# Altium project BC-MPR.PrjPcb (part 1 of 2)
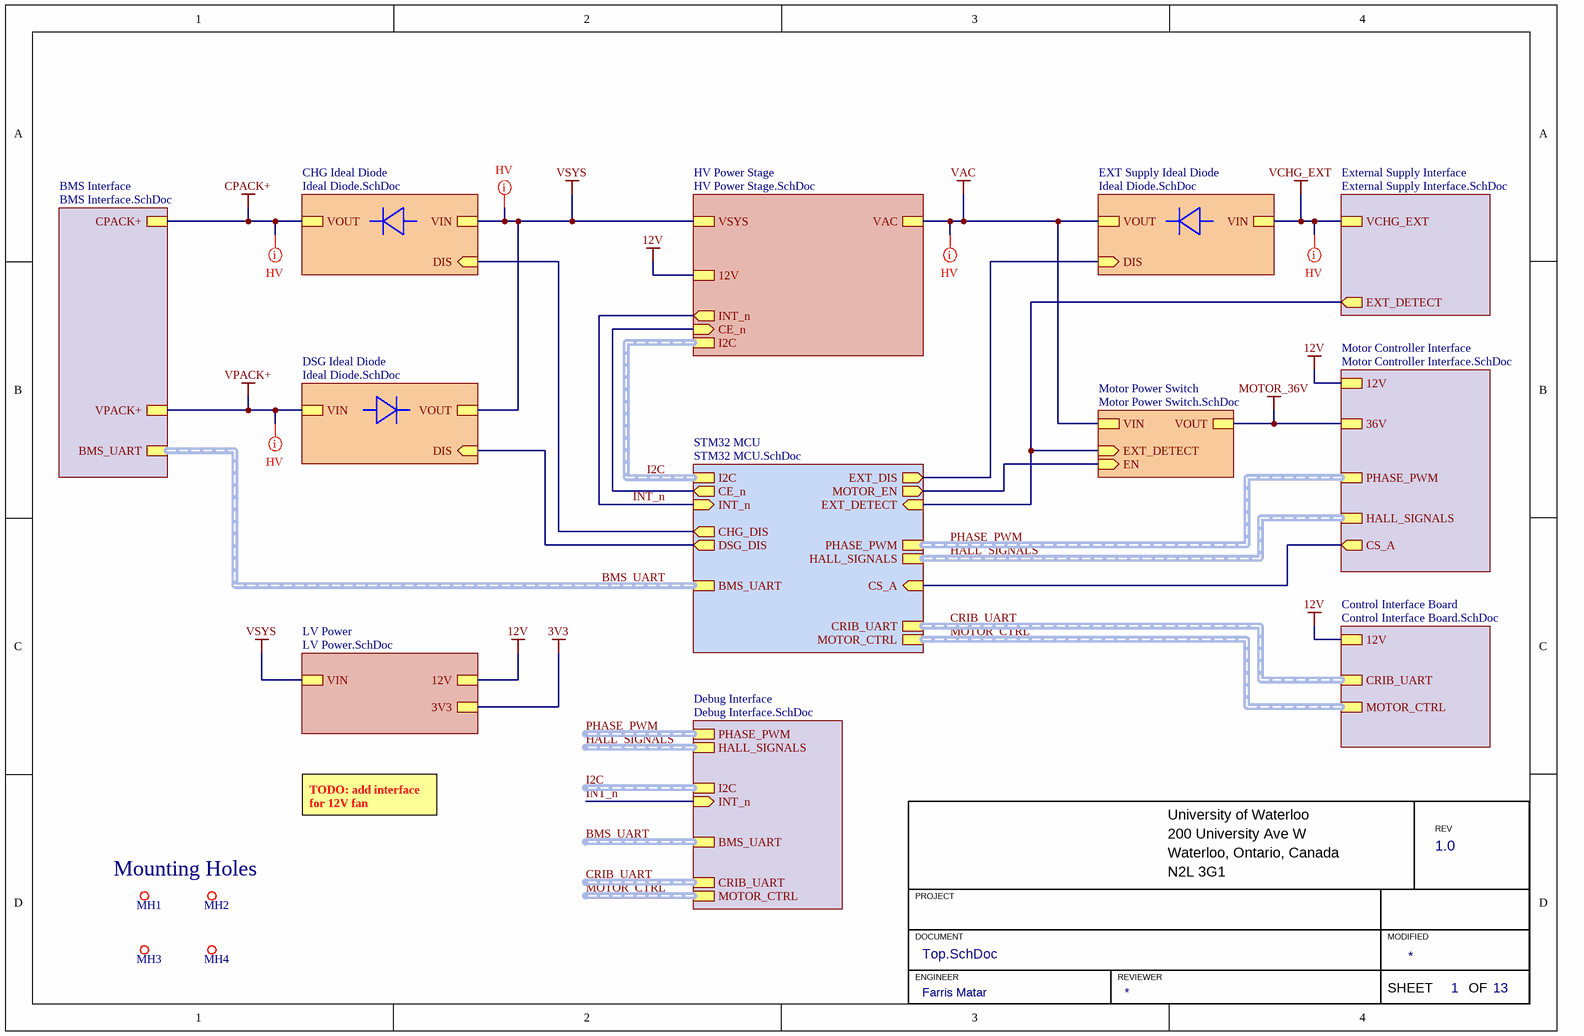
[diagram p0: Top.SchDoc]
Engineer: Farris Matar; Revision: 1.0
12 sheets, 243 parts. Net scope: hierarchical (ports join the sheet entries above them; power ports are global).
Board file: BC-MPR.PcbDoc
Sheets:
  Top.SchDoc
    CHG Ideal Diode = Ideal Diode.SchDoc
    DSG Ideal Diode = Ideal Diode.SchDoc
    EXT Supply Ideal Diode = Ideal Diode.SchDoc
    Motor Controller Interface = Motor Controller Interface.SchDoc
    Motor Power Switch = Motor Power Switch.SchDoc
    LV Power = LV Power.SchDoc
    HV Power Stage = HV Power Stage.SchDoc
      BQ25756 Data & Config = BQ25756 Data Config.SchDoc
    STM32 MCU = STM32 MCU.SchDoc
      MCU Power, Clock, & Debug = MCU Power Clock Debug.SchDoc
    Control Interface Board = Control Interface Board.SchDoc
    External Supply Interface = External Supply Interface.SchDoc
  Fan Power Switch.SchDoc

## Sheet Top.SchDoc
size A4; Engineer: Farris Matar; Organization: TESLA Motors, INC; Address1: 3500 Deer Creek Road; Address2: Palo Alto, CA; Address4: U.S.A.; SheetNumber: 1; SheetTotal: 13

### Parts
MH1  MOUNTING_HOLE_M3  [MOUNTING_HOLE_3mm]  (value not drawn)  (no BOM)
MH2  MOUNTING_HOLE_M3  [MOUNTING_HOLE_3mm]  (value not drawn)  (no BOM)
MH3  MOUNTING_HOLE_M3  [MOUNTING_HOLE_3mm]  (value not drawn)  (no BOM)
MH4  MOUNTING_HOLE_M3  [MOUNTING_HOLE_3mm]  (value not drawn)  (no BOM)

### Sub-sheets
BMS Interface = BMS Interface.SchDoc (file not in this document): BMS_UART (harness UART), VPACK+, CPACK+
CHG Ideal Diode = Ideal Diode.SchDoc: VOUT, VIN, DIS (in)
Control Interface Board = Control Interface Board.SchDoc: CRIB_UART (harness UART), MOTOR_CTRL (harness MOTOR CTRL), 12V
Debug Interface = Debug Interface.SchDoc (file not in this document): BMS_UART (harness UART), CRIB_UART (harness UART), I2C (harness I2C), HALL_SIGNALS (harness HALL SIGNALS), PHASE_PWM (harness PHASE PWM), MOTOR_CTRL (harness MOTOR CTRL), INT_n (in)
DSG Ideal Diode = Ideal Diode.SchDoc: VOUT, VIN, DIS (in)
EXT Supply Ideal Diode = Ideal Diode.SchDoc: VOUT, VIN, DIS (in)
External Supply Interface = External Supply Interface.SchDoc: VCHG_EXT, EXT_DETECT (out)
HV Power Stage = HV Power Stage.SchDoc: VSYS, VAC, 12V, INT_n (out), I2C (harness I2C), CE_n (in)
LV Power = LV Power.SchDoc: VIN, 12V, 3V3
Motor Controller Interface = Motor Controller Interface.SchDoc: 36V, 12V, CS_A (out), PHASE_PWM (harness PHASE PWM), HALL_SIGNALS (harness HALL SIGNALS)
Motor Power Switch = Motor Power Switch.SchDoc: VIN, VOUT, EN (in), EXT_DETECT (in)
STM32 MCU = STM32 MCU.SchDoc: HALL_SIGNALS (harness HALL SIGNALS), PHASE_PWM (harness PHASE PWM), CS_A (in), BMS_UART (harness UART), MOTOR_EN (out), EXT_DIS (out), I2C (harness I2C), CE_n (out), INT_n (in), CHG_DIS (out), DSG_DIS (out), CRIB_UART (harness UART), EXT_DETECT (in), MOTOR_CTRL (harness MOTOR CTRL)

### Nets
12V: sheet Motor Controller Interface/12V, sheet LV Power/12V, sheet HV Power Stage/12V, sheet Control Interface Board/12V
CPACK+: sheet CHG Ideal Diode/VOUT, sheet BMS Interface/CPACK+
MOTOR_36V: sheet Motor Controller Interface/36V, sheet Motor Power Switch/VOUT
VAC: sheet EXT Supply Ideal Diode/VOUT, sheet Motor Power Switch/VIN, sheet HV Power Stage/VAC
VCHG_EXT: sheet EXT Supply Ideal Diode/VIN, sheet External Supply Interface/VCHG_EXT
VPACK+: sheet DSG Ideal Diode/VIN, sheet BMS Interface/VPACK+
VSYS: sheet CHG Ideal Diode/VIN, sheet DSG Ideal Diode/VOUT, sheet LV Power/VIN, sheet HV Power Stage/VSYS
CE_n: sheet HV Power Stage/CE_n, sheet STM32 MCU/CE_n
CHG_DIS: sheet CHG Ideal Diode/DIS, sheet STM32 MCU/CHG_DIS
CS_A: sheet Motor Controller Interface/CS_A, sheet STM32 MCU/CS_A
DSG_DIS: sheet DSG Ideal Diode/DIS, sheet STM32 MCU/DSG_DIS
EXT_DETECT: sheet Motor Power Switch/EXT_DETECT, sheet STM32 MCU/EXT_DETECT, sheet External Supply Interface/EXT_DETECT
EXT_DIS: sheet EXT Supply Ideal Diode/DIS, sheet STM32 MCU/EXT_DIS
INT_n: sheet HV Power Stage/INT_n, sheet STM32 MCU/INT_n, sheet Debug Interface/INT_n
MOTOR_EN: sheet Motor Power Switch/EN, sheet STM32 MCU/MOTOR_EN

### Buses and harness runs
harness BMS_UART = sheet BMS Interface/BMS_UART = sheet STM32 MCU/BMS_UART
harness BMS_UART = sheet Debug Interface/BMS_UART
harness CRIB_UART = sheet Control Interface Board/CRIB_UART = sheet STM32 MCU/CRIB_UART
harness CRIB_UART = sheet Debug Interface/CRIB_UART
harness HALL_SIGNALS = sheet Debug Interface/HALL_SIGNALS
harness HALL_SIGNALS = sheet Motor Controller Interface/HALL_SIGNALS = sheet STM32 MCU/HALL_SIGNALS
harness I2C = sheet Debug Interface/I2C
harness I2C = sheet HV Power Stage/I2C = sheet STM32 MCU/I2C
harness MOTOR_CTRL = sheet Control Interface Board/MOTOR_CTRL = sheet STM32 MCU/MOTOR_CTRL
harness MOTOR_CTRL = sheet Debug Interface/MOTOR_CTRL
harness PHASE_PWM = sheet Debug Interface/PHASE_PWM
harness PHASE_PWM = sheet Motor Controller Interface/PHASE_PWM = sheet STM32 MCU/PHASE_PWM

### Layout directives
net class HV: CPACK+, VAC, VCHG_EXT, VPACK+, VSYS

### Notes on the sheet
- TODO: add interface for 12V fan
- University of Waterloo
- 200 University Ave W
- REV
- Mounting Holes
- PROJECT
- Waterloo, Ontario, Canada
- N2L 3G1
- DOCUMENT
- ENGINEER
- REVIEWER
- MODIFIED
- SHEET
- OF

## Sheet Ideal Diode.SchDoc
size A4; Engineer: Farris Matar; Organization: TESLA Motors, INC; Address1: 3500 Deer Creek Road; Address2: Palo Alto, CA; Address4: U.S.A.; SheetNumber: 2; SheetTotal: 9
Used 3 times, as channels CHG Ideal Diode, DSG Ideal Diode, EXT Supply Ideal Diode. Parts and nets are listed once, with the designators drawn on the sheet.
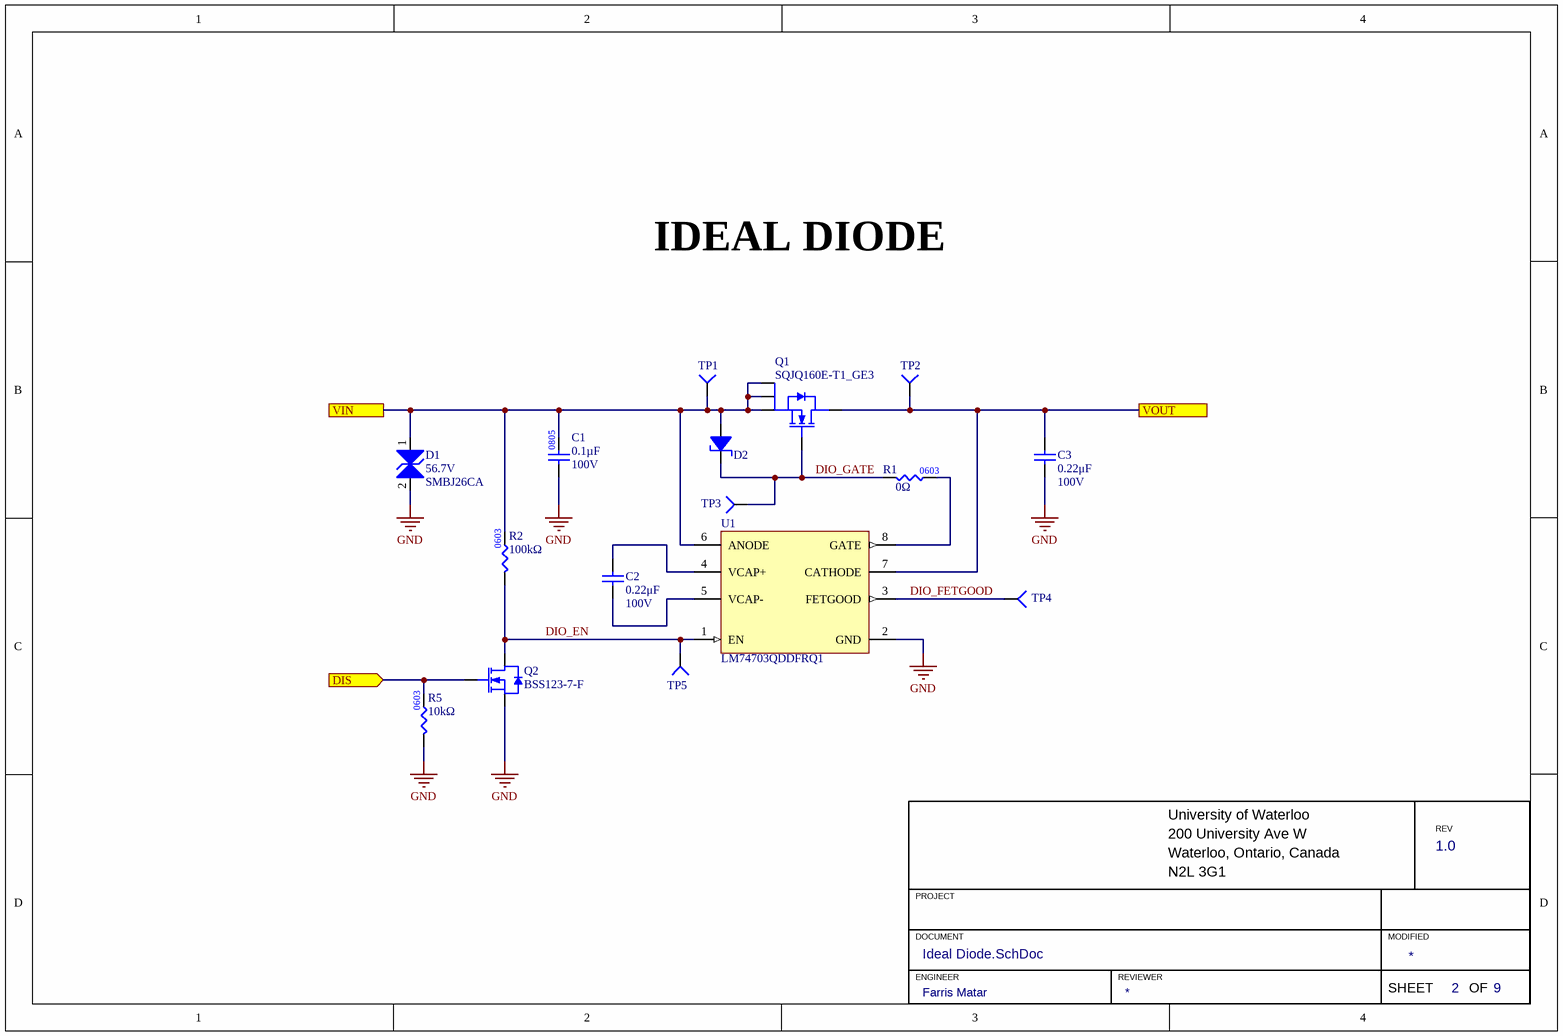
[diagram p1: Ideal Diode.SchDoc]

### Parts
C1  value 0.1µF  Voltage Rating: 100V  [CAP0805]  (hidden comment: CAP_0.1uF_100V_0805)
C2  value 0.22μF  Voltage Rating: 100V  [CAP0805]  (hidden comment: CAP_0.22uF_100V_0805)
C3  value 0.22μF  Voltage Rating: 100V  [CAP0805]  (hidden comment: CAP_0.22uF_100V_0805)
D1  Voltage - Breakdown (Min): 56.7V  Manufacturer Part Number 1: SMBJ26CA  [TVS_DIODE_BIDIR_SMB]  (hidden comment: TVS_DIODE_BIDIR_51V)
D2  DIO_ZENER_16V  [SOD-123_FLAT]  (value not drawn)
Q1  Manufacturer Part Number 1: SQJQ160E-T1_GE3  [VISHAY_PowerPAK-8x8]  (hidden comment: NMOS_60V_603A)
Q2  Manufacturer Part Number 1: BSS123-7-F  [SOT23-3]  (hidden comment: NMOS_100V_170mA)
R1  value 0Ω  [RES0603]  (hidden comment: RES_0Ω_0603)
R2  value 100kΩ  [RES0603]  (hidden comment: RES_100kΩ_0603_1%)
R5  value 10kΩ  [RES0603]  (hidden comment: RES_10kΩ_0603_1%)
TP1  TESTPOINT_1MM_SQUARE  [TESTPOINT_SQUARE_1MM]  (value not drawn)  (no BOM)
TP2  TESTPOINT_1MM_SQUARE  [TESTPOINT_SQUARE_1MM]  (value not drawn)  (no BOM)
TP3  TESTPOINT_1MM_CIRCLE  [TESTPOINT_CIRCLE_1MM]  (value not drawn)  (no BOM)
TP4  TESTPOINT_1MM_CIRCLE  [TESTPOINT_CIRCLE_1MM]  (value not drawn)  (no BOM)
TP5  TESTPOINT_1MM_CIRCLE  [TESTPOINT_CIRCLE_1MM]  (value not drawn)  (no BOM)
U1  LM74703QDDFRQ1  [TI_SOT23-8]

### Ports
DIS (in), VIN, VOUT

### Nets
GND: C1.1 C3.1 D1.2 Q2.2(SOURCE) R5.1 U1.2(GND)
DIO_EN: Q2.3(DRAIN) R2.1 TP5.1(=value) U1.1(EN)
DIO_FETGOOD: TP4.1(=value) U1.3(FETGOOD)
DIO_GATE: D2.2(Cathode) Q1.1(Gate) R1.1 TP3.1(=value)
DIS: Q2.1(GATE) R5.2 ; port DIS
VIN: C1.2 D1.1 D2.1(Anode) Q1.2(Source) Q1.3(Source) Q1.4(Source) R2.2 TP1.1(=value) U1.6(ANODE) ; port VIN
VOUT: C3.2 Q1.5(Drain) TP2.1(=value) U1.7(CATHODE) ; port VOUT
NetC2_1: C2.1 U1.5(VCAP-)
NetC2_2: C2.2 U1.4(VCAP+)
NetR1_2: R1.2 U1.8(GATE)

### Channels
CHG Ideal Diode: designators end in A; ports DIS=CHG_DIS VIN=VSYS VOUT=CPACK+
DSG Ideal Diode: designators end in B; ports DIS=DSG_DIS VIN=VPACK+ VOUT=VSYS
EXT Supply Ideal Diode: designators end in C; ports DIS=EXT_DIS VIN=VCHG_EXT VOUT=VAC

### Notes on the sheet
- IDEAL DIODE
- University of Waterloo
- 200 University Ave W
- REV
- PROJECT
- Waterloo, Ontario, Canada
- N2L 3G1
- DOCUMENT
- ENGINEER
- REVIEWER
- MODIFIED
- SHEET
- OF
- (in symbol RES_100kΩ_0603_1%) 0603

### Library data of the parts
C1 = CAP_0.1uF_100V_0805: CAP CER 0.1UF 100V X7R 0805; Manufacturer 1: TDK Corporation; Manufacturer Part Number 1: C2012X7R2A104K125AA; Package: 0805; Supplier 1: Digi-Key; Supplier Part Number 1: 445-1418-1-ND
C2 C3 = CAP_0.22uF_100V_0805: CAP CER 0.22UF 100V X7R 0805; Manufacturer Part Number 1: HMJ212BB7224KGHT; Manufacturer 1: Taiyo Yuden; Mounting Type: SMD; Package: 0805; Dielectric: X7R; Supplier 1: Digi-Key; Supplier Part Number 1: 587-4221-1-ND
D1 = TVS_DIODE_BIDIR_51V: TVS DIODE 51VWM 82.4VC DO214AA; Manufacturer 1: Littelfuse; Package/Footprint: SMB; Voltage - Clamping (Max) @ Ipp: 82.4V; Voltage - Reverse Standoff (Typ): 51V; Mounting Type: SMD; Supplier 1: Digi-Key; Supplier Part Number 1: SMBJ51CALFCT-ND
D2 = DIO_ZENER_16V: DIODE ZENER 16V 500MW SOD123; Manufacturer Part Number 1: DDZ9703-7; Manufacturer 1: Diodes Incorporated; Forward Voltage: 900mV; Supplier 1: Digi-Key; Supplier Part Number 1: DDZ9703-7DICT-ND
Q1 = NMOS_60V_603A: AUTOMOTIVE N-CHANNEL 60 V (D-S); Manufacturer 1: Vishay Siliconix; Vdss: 60V; Vgs (Max): 20V; Power Dissipation (Max): 600W; Id: 603A; Supplier 1: Digi-Key; Supplier Part Number 1: 742-SQJQ160E-T1_GE3CT-ND; FET Type: N-Channel; Supplier Device Package: PowerPak 8x8
Q2 = NMOS_100V_170mA: MOSFET N-CH 100V 170MA SOT23-3; Manufacturer 1: Diodes Incorporated; Supplier 1: Digi-Key; Supplier Part Number 1: BSS123-FDICT-ND
R1 = RES_0Ω_0603: RES 0 OHM JUMPER 1/10W 0603; Manufacturer 1: Yageo; Manufacturer Part Number 1: RC0603JR-070RL; Supplier Part Number 1: 311-0.0GRCT-ND; Supplier 1: Digi-Key; Mounting Type: SMD; Package: 0603
R2 = RES_100kΩ_0603_1%: RES 100K OHM 1% 1/10W 0603; Manufacturer 1: Yageo; Manufacturer Part Number 1: RC0603FR-07100KL; Supplier Part Number 1: 311-100KHRCT-ND; Supplier 1: Digi-Key
R5 = RES_10kΩ_0603_1%: RES 10K OHM 1% 1/8W 0603; Manufacturer 1: Stackpole Electronics Inc; Manufacturer Part Number 1: RNCP0603FTD10K0; Supplier Part Number 1: RNCP0603FTD10K0CT-ND; Supplier 1: Digi-Key; Mounting Type: SMD; Package: 0603
TP1 TP2 = TESTPOINT_1MM_SQUARE: TESTPOINT 1MM SQUARE
TP3-TP5 = TESTPOINT_1MM_CIRCLE: TESTPOINT 1MM CIRCLE
U1 = LM74703QDDFRQ1: AUTOMOTIVE IDEAL DIODE CONTROLLE; Manufacturer 1: Texas Instruments; Package/Footprint: SOT-23; Manufacturer Part Number 1: LM74703QDDFRQ1; Supplier 1: Digikey; Supplier Part Number 1: 296-LM74703QDDFRQ1CT-ND

## Sheet Motor Controller Interface.SchDoc
size A4; Engineer: Farris Matar; Organization: TESLA Motors, INC; Address1: 3500 Deer Creek Road; Address2: Palo Alto, CA; Address4: U.S.A.; SheetNumber: 4; SheetTotal: 9
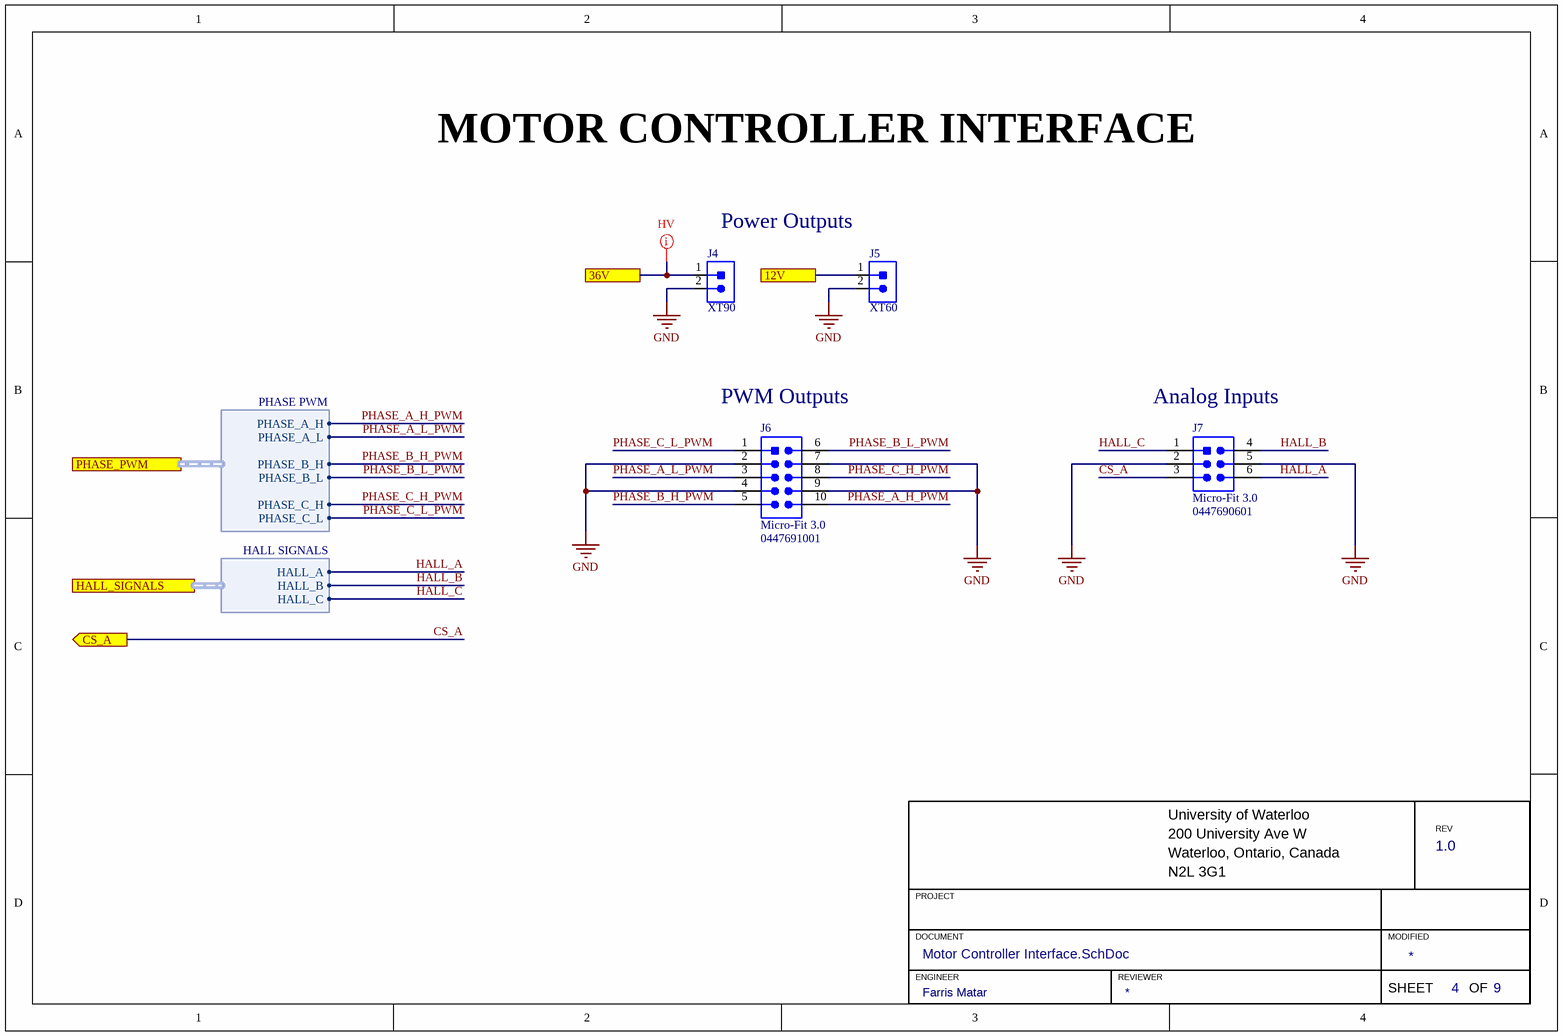
[diagram p2: Motor Controller Interface.SchDoc]

### Parts
J4  CON_2POS_XT90  [XT90]  (value not drawn)
J5  CON_2POS_XT60  [XT60]  (value not drawn)
J6  Family: Micro-Fit 3.0  [MOLEX-0447691001]  (hidden comment: 0447691001)
J7  Family: Micro-Fit 3.0  [MOLEX-0447690601]  (hidden comment: 0447690601)

### Ports
12V, 36V, CS_A (out), HALL_SIGNALS (harness HALL SIGNALS), PHASE_PWM (harness PHASE PWM)

### Harnesses
PHASE PWM: PHASE_A_H, PHASE_A_L, PHASE_B_H, PHASE_B_L, PHASE_C_H, PHASE_C_L
HALL SIGNALS: HALL_A, HALL_B, HALL_C

### Nets
12V: J5.1 ; port 12V
GND: J4.2 J5.2 J6.2 J6.4 J6.7 J6.9 J7.2 J7.5
MOTOR_36V: J4.1 ; port 36V
CS_A: J7.3 ; port CS_A
HALL_A: J7.6 ; port HALL_SIGNALS.HALL_A
HALL_B: J7.4 ; port HALL_SIGNALS.HALL_B
HALL_C: J7.1 ; port HALL_SIGNALS.HALL_C
PHASE_A_H_PWM: J6.10 ; port PHASE_PWM.PHASE_A_H
PHASE_A_L_PWM: J6.3 ; port PHASE_PWM.PHASE_A_L
PHASE_B_H_PWM: J6.5 ; port PHASE_PWM.PHASE_B_H
PHASE_B_L_PWM: J6.6 ; port PHASE_PWM.PHASE_B_L
PHASE_C_H_PWM: J6.8 ; port PHASE_PWM.PHASE_C_H
PHASE_C_L_PWM: J6.1 ; port PHASE_PWM.PHASE_C_L

### Layout directives
net class HV: MOTOR_36V

### Notes on the sheet
- MOTOR CONTROLLER INTERFACE
- Power Outputs
- (near J6) PWM Outputs
- (near J7) Analog Inputs
- University of Waterloo
- 200 University Ave W
- REV
- PROJECT
- Waterloo, Ontario, Canada
- N2L 3G1
- DOCUMENT
- ENGINEER
- REVIEWER
- MODIFIED
- SHEET
- OF

### Library data of the parts
J4 = CON_2POS_XT90: HIGH QUALITY GOLD PLATED XT90 MA; Manufacturer 1: DFRobot; Manufacturer Part Number 1: FIT0588; Mounting Type: TH; Package/Footprint: XT90; Supplier 1: Digi-Key; Supplier Part Number 1: 1738-1438-ND
J5 = CON_2POS_XT60: XT60 CONNECTORS MALE/FEMALE PAIR; Manufacturer 1: SparkFun Electronics; Manufacturer Part Number 1: PRT-10474; Mounting Type: TH; Package/Footprint: XT60; Supplier 1: Digi-Key; Supplier Part Number 1: 1568-1816-ND
J6 = CON_MOLEX-RCPT_5x2_TH: CONN RCPT 10POS 0.118 TIN PCB; Manufacturer 1: Molex; Voltage Rating: 250VAC; Current Rating: 5A; Pitch: 3mm; Supplier 1: Digi-Key; Supplier Part Number 1: WM1956-ND; Manufacturer Part Number 1: 0447691001
J7 = CON_MOLEX-RCPT_3x2_TH: CONN RCPT 6POS 0.118 TIN PCB; Manufacturer 1: Molex; Voltage Rating: 250VAC; Current Rating: 5A; Pitch: 3mm; Supplier 1: Digi-Key; Supplier Part Number 1: 23-0447690601-ND; Manufacturer Part Number 1: 0447690601

## Sheet Motor Power Switch.SchDoc
size A4; Engineer: Farris Matar; Organization: TESLA Motors, INC; Address1: 3500 Deer Creek Road; Address2: Palo Alto, CA; Address4: U.S.A.; SheetNumber: 4; SheetTotal: 13
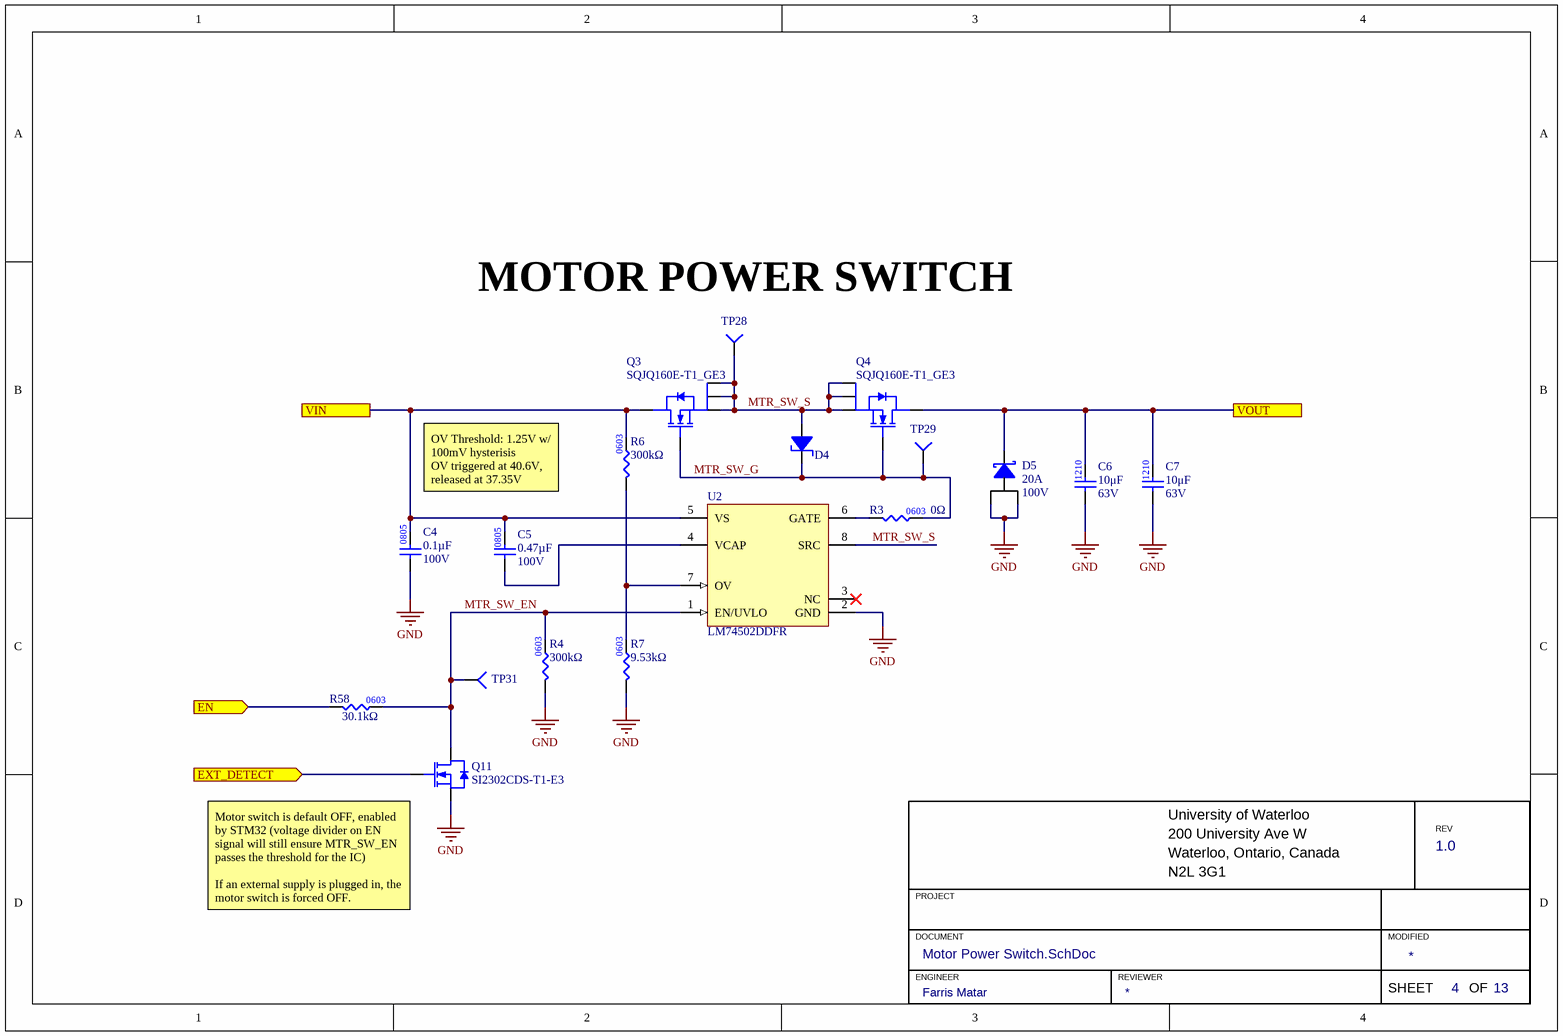
[diagram p3: Motor Power Switch.SchDoc]

### Parts
C4  value 0.1µF  Voltage Rating: 100V  [CAP0805]  (hidden comment: CAP_0.1uF_100V_0805)
C5  value 0.47µF  Voltage Rating: 100V  [CAP0805]  (hidden comment: CAP_0.47uF_100V_0805)
C6  value 10μF  Voltage Rating: 63V  [CAP1210]  (hidden comment: CAP_10uF_63V_1210)
C7  value 10μF  Voltage Rating: 63V  [CAP1210]  (hidden comment: CAP_10uF_63V_1210)
D4  DIO_ZENER_16V  [SOD-123_FLAT]  (value not drawn)
D5  Current - Average Rectified (Io): 20A  Vr (Max): 100V  [D-PAK]  (hidden comment: DIO_SCHOTTKY_100V_20A)
Q3  Manufacturer Part Number 1: SQJQ160E-T1_GE3  [VISHAY_PowerPAK-8x8]  (hidden comment: NMOS_60V_603A)
Q4  Manufacturer Part Number 1: SQJQ160E-T1_GE3  [VISHAY_PowerPAK-8x8]  (hidden comment: NMOS_60V_603A)
Q11  Manufacturer Part Number 1: SI2302CDS-T1-E3  [SOT23-3]  (hidden comment: NMOS_20V_6A)
R3  value 0Ω  [RES0603]  (hidden comment: RES_0Ω_0603)
R4  value 300kΩ  [RES0603]  (hidden comment: RES_300kΩ_0603_1%)
R6  value 300kΩ  [RES0603]  (hidden comment: RES_300kΩ_0603_1%)
R7  value 9.53kΩ  [RES0603]  (hidden comment: RES_9.53kΩ_0603_1%)
R58  value 30.1kΩ  [RES0603]  (hidden comment: RES_30.1kΩ_0603_1%)
TP28  TESTPOINT_1MM_SQUARE  [TESTPOINT_SQUARE_1MM]  (value not drawn)  (no BOM)
TP29  TESTPOINT_1MM_CIRCLE  [TESTPOINT_CIRCLE_1MM]  (value not drawn)  (no BOM)
TP31  TESTPOINT_1MM_CIRCLE  [TESTPOINT_CIRCLE_1MM]  (value not drawn)  (no BOM)
U2  LM74502DDFR  [TI_SOT23-8]

### Ports
EN (in), EXT_DETECT (in), VIN, VOUT

### Nets
GND: C4.1 C6.1 C7.1 D5.2(Anode) D5.3(Anode) Q11.2(SOURCE) R4.1 R7.1 U2.2(GND)
MOTOR_36V: C6.2 C7.2 D5.1(Cathode) Q4.5(Drain) ; port VOUT
VAC: C4.2 C5.2 Q3.5(Drain) R6.2 U2.5(VS) ; port VIN
EXT_DETECT: Q11.1(GATE) ; port EXT_DETECT
MOTOR_EN: R58.1 ; port EN
MTR_SW_EN: Q11.3(DRAIN) R4.2 R58.2 TP31.1(=value) U2.1(EN/UVLO)
MTR_SW_G: D4.2(Cathode) Q3.1(Gate) Q4.1(Gate) R3.2 TP29.1(=value)
MTR_SW_S: D4.1(Anode) Q3.2(Source) Q3.3(Source) Q3.4(Source) Q4.2(Source) Q4.3(Source) Q4.4(Source) TP28.1(=value) U2.8(SRC)
NetC5_1: C5.1 U2.4(VCAP)
NetR3_1: R3.1 U2.6(GATE)
NetR6_1: R6.1 R7.2 U2.7(OV)

Not connected (* = marked no-connect by the designer): U2 3(NC)*

### Notes on the sheet
- (near TP28) MOTOR POWER SWITCH
- OV Threshold: 1.25V w/ 100mV hysterisis
  OV triggered at 40.6V, released at 37.35V
- University of Waterloo
- 200 University Ave W
- REV
- (near Q11) Motor switch is default OFF, enabled by STM32 (voltage divider on EN signal will still ensure MTR_SW_EN passes the threshold for the IC)
  If an external supply is plugged in, the motor switch is forced OFF.
- PROJECT
- Waterloo, Ontario, Canada
- N2L 3G1
- DOCUMENT
- ENGINEER
- REVIEWER
- MODIFIED
- SHEET
- OF

### Library data of the parts
C4 = CAP_0.1uF_100V_0805: as C1 on sheet Ideal Diode; Package: 0805; Supplier 1: Digi-Key; Supplier Part Number 1: 445-1418-1-ND
C5 = CAP_0.47uF_100V_0805: CAP CER 0.47UF 100V X7R 0805; Manufacturer 1: YAGEO; Manufacturer Part Number 1: CC0805KKX7R0BB474; Package: 0805; Supplier 1: Digikey; Supplier Part Number 1: 13-CC0805KKX7R0BB474DKR-ND
C6 C7 = CAP_10uF_63V_1210: CAP CER 10UF 63V X7R 1210; Manufacturer 1: Samsung Electro-Mechanics; Manufacturer Part Number 1: CL32B106KMVNNWE; Mounting Type: SMD; Package: 1210; Dielectric: X7R; Supplier 1: Digikey; Supplier Part Number 1: 1276-7053-6-ND
D4 = DIO_ZENER_16V: as D2 on sheet Ideal Diode; Supplier 1: Digi-Key; Supplier Part Number 1: DDZ9703-7DICT-ND
D5 = DIO_SCHOTTKY_100V_20A: 100V, 20A, DPAK, DIODE SCHOTTKY; Manufacturer 1: SMC Diode Solutions; Manufacturer Part Number 1: MBRD20100; Mounting Type: SMD; Package/Footprint: DPAK; Supplier 1: Digikey; Supplier Part Number 1: 1655-MBRD20100CTDKR-ND
Q3 Q4 = NMOS_60V_603A: as Q1 on sheet Ideal Diode; Supplier 1: Digi-Key; Supplier Part Number 1: 742-SQJQ160E-T1_GE3CT-ND; FET Type: N-Channel; Supplier Device Package: PowerPak 8x8
Q11 = NMOS_20V_2.6A: MOSFET N-CH 20V 2.6A SOT23-3; Manufacturer 1: Vishay Siliconix; Package/Footprint: SOT-23-3; Supplier 1: Digi-Key; Supplier Part Number 1: SI2302CDS-T1-E3CT-ND
R3 = RES_0Ω_0603: as R1 on sheet Ideal Diode; Supplier Part Number 1: 311-0.0GRCT-ND; Supplier 1: Digi-Key; Mounting Type: SMD; Package: 0603
R4 R6 = RES_300kΩ_0603_1%: RES 300K OHM 1% 1/10W 0603; Manufacturer 1: Stackpole Electronics Inc; Manufacturer Part Number 1: RMCF0603FT300K; Supplier Part Number 1: RMCF0603FT300KCT-ND; Supplier 1: Digi-Key; Package: 0603; Tolerance: 1%
R7 = RES_9.53kΩ_0603_1%: RES 9.53K OHM 1% 1/10W 0603; Manufacturer 1: Stackpole Electronics Inc; Manufacturer Part Number 1: RC0603FR-079K53L; Supplier Part Number 1: 311-9.53KHRCT-ND; Supplier 1: Digi-Key; Mounting Type: SMD; Package: 0603
R58 = RES_30.1kΩ_0603_1%: RES 30.1K OHM 1% 1/10W 0603; Manufacturer 1: Panasonic Electronic Components; Manufacturer Part Number 1: ERJ-3EKF3012V; Mounting Type: SMD; Package: 0603; Supplier 1: Digikey; Supplier Part Number 1: P30.1KHCT-ND
TP28 = TESTPOINT_1MM_SQUARE: TESTPOINT 1MM SQUARE
TP29 TP31 = TESTPOINT_1MM_CIRCLE: TESTPOINT 1MM CIRCLE
U2 = LM74502DDFR: 3.2-V TO 65-V INDUSTRIAL RPP CON; Manufacturer 1: Texas Instruments; Package/Footprint: SOT-23; Manufacturer Part Number 1: LM74502DDFR; Supplier 1: Digikey; Supplier Part Number 1: 296-LM74502DDFRCT-ND

## Sheet LV Power.SchDoc
size A4; Engineer: Farris Matar; Organization: TESLA Motors, INC; Address1: 3500 Deer Creek Road; Address2: Palo Alto, CA; Address4: U.S.A.; SheetNumber: 6; SheetTotal: 13
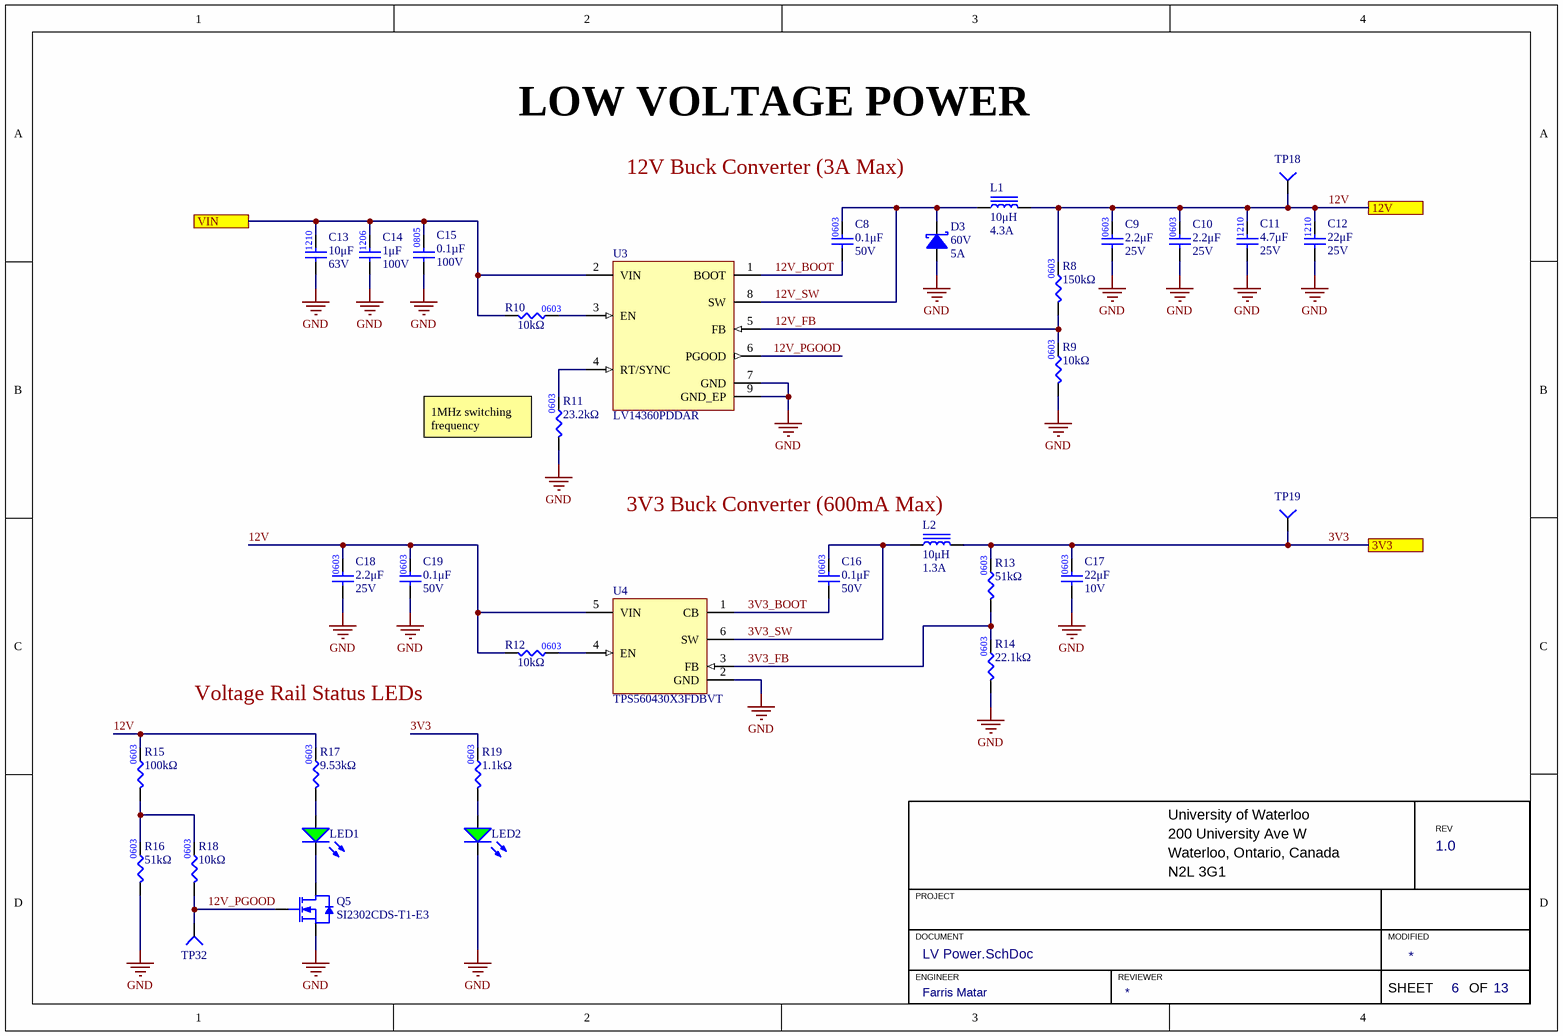
[diagram p4: LV Power.SchDoc]

### Parts
C8  value 0.1μF  Voltage Rating: 50V  [CAP0603]  (hidden comment: CAP_0.1uF_50V_0603)
C9  value 2.2μF  Voltage Rating: 25V  [CAP0603]  (hidden comment: CAP_2.2uF_25V_0603)
C10  value 2.2μF  Voltage Rating: 25V  [CAP0603]  (hidden comment: CAP_2.2uF_25V_0603)
C11  value 4.7μF  Voltage Rating: 25V  [CAP1210]  (hidden comment: CAP_4.7uF_25V_1210)
C12  value 22μF  Voltage Rating: 25V  [CAP1210]  (hidden comment: CAP_22uF_25V_1210)
C13  value 10μF  Voltage Rating: 63V  [CAP1210]  (hidden comment: CAP_10uF_63V_1210)
C14  value 1μF  Voltage Rating: 100V  [CAP1206]  (hidden comment: CAP_1uF_100V_1206)
C15  value 0.1µF  Voltage Rating: 100V  [CAP0805]  (hidden comment: CAP_0.1uF_100V_0805)
C16  value 0.1μF  Voltage Rating: 50V  [CAP0603]  (hidden comment: CAP_0.1uF_50V_0603)
C17  value 22μF  Voltage Rating: 10V  [CAP0603]  (hidden comment: CAP_22uF_10V_0603)
C18  value 2.2μF  Voltage Rating: 25V  [CAP0603]  (hidden comment: CAP_2.2uF_25V_0603)
C19  value 0.1μF  Voltage Rating: 50V  [CAP0603]  (hidden comment: CAP_0.1uF_50V_0603)
D3  Vr (Max): 60V  Current - Average Rectified (Io): 5A  [DIO-INC_SMA]  (hidden comment: DIO_SCHOTTKY_60V_5A)
L1  value 10μH  Current Rating: 4.3A  [IND_MURATA_DS106C2]  (hidden comment: IND_10uH_4.3A)
L2  value 10μH  Current Rating: 1.3A  [IND_ABRACON_ASPI4030S]  (hidden comment: IND_10uH_1.3A)
LED1  LED_GREEN_0805  [LED_0805_GREEN]  (value not drawn)
LED2  LED_GREEN_0805  [LED_0805_GREEN]  (value not drawn)
Q5  Manufacturer Part Number 1: SI2302CDS-T1-E3  [SOT23-3]  (hidden comment: NMOS_20V_6A)
R8  value 150kΩ  [RES0603]  (hidden comment: RES_150kΩ_0603_1%)
R9  value 10kΩ  [RES0603]  (hidden comment: RES_10kΩ_0603_1%)
R10  value 10kΩ  [RES0603]  (hidden comment: RES_10kΩ_0603_1%)
R11  value 23.2kΩ  [RES0603]  (hidden comment: RES_23.2kΩ_0603_1%)
R12  value 10kΩ  [RES0603]  (hidden comment: RES_10kΩ_0603_1%)
R13  value 51kΩ  [RES0603]  (hidden comment: RES_51kΩ_0603_1%)
R14  value 22.1kΩ  [RES0603]  (hidden comment: RES_22.1kΩ_0603_1%)
R15  value 100kΩ  [RES0603]  (hidden comment: RES_100kΩ_0603_1%)
R16  value 51kΩ  [RES0603]  (hidden comment: RES_51kΩ_0603_1%)
R17  value 9.53kΩ  [RES0603]  (hidden comment: RES_9.53kΩ_0603_1%)
R18  value 10kΩ  [RES0603]  (hidden comment: RES_10kΩ_0603_1%)
R19  value 1.1kΩ  [RES0603]  (hidden comment: RES_1.1kΩ_0603_1%)
TP18  TESTPOINT_KEYSTONE_LOOP  [KEYSTONE_5019]  (value not drawn)
TP19  TESTPOINT_KEYSTONE_LOOP  [KEYSTONE_5019]  (value not drawn)
TP32  TESTPOINT_1MM_CIRCLE  [TESTPOINT_CIRCLE_1MM]  (value not drawn)  (no BOM)
U3  LV14360PDDAR  [TI_8-PowerPad-SOIC]
U4  TPS560430X3FDBVT  [SOT23-6]

### Ports
3V3, 12V, VIN

### Nets
3V3: C17.2 L2.2 R13.2 R19.2 TP19.1(=value) ; port 3V3
12V: C9.2 C10.2 C11.2 C12.2 C18.2 C19.2 L1.2 R8.2 R12.1 R15.2 R17.2 TP18.1(=value) U4.5(VIN) ; port 12V
GND: C9.1 C10.1 C11.1 C12.1 C13.1 C14.1 C15.1 C17.1 C18.1 C19.1 D3.2(Anode) LED2.2(K) Q5.2(SOURCE) R9.1 R11.1 R14.1 R16.1 U3.7(GND) U3.9(GND_EP) U4.2(GND)
VSYS: C13.2 C14.2 C15.2 R10.1 U3.2(VIN) ; port VIN
3V3_BOOT: C16.1 U4.1(CB)
3V3_FB: R13.1 R14.2 U4.3(FB)
3V3_SW: C16.2 L2.1 U4.6(SW)
12V_BOOT: C8.1 U3.1(BOOT)
12V_FB: R8.1 R9.2 U3.5(FB)
12V_PGOOD: Q5.1(GATE) R18.1 TP32.1(=value) U3.6(PGOOD)
12V_SW: C8.2 D3.1(Cathode) L1.1 U3.8(SW)
NetLED1_1: LED1.1(A) R17.1
NetLED1_2: LED1.2(K) Q5.3(DRAIN)
NetLED2_1: LED2.1(A) R19.1
NetR10_2: R10.2 U3.3(EN)
NetR11_2: R11.2 U3.4(RT/SYNC)
NetR12_2: R12.2 U4.4(EN)
NetR15_1: R15.1 R16.2 R18.2

### Notes on the sheet
- LOW VOLTAGE POWER
- 12V Buck Converter (3A Max)
- (near R11) 1MHz switching frequency
- (near L2) 3V3 Buck Converter (600mA Max)
- Voltage Rail Status LEDs
- University of Waterloo
- 200 University Ave W
- REV
- PROJECT
- Waterloo, Ontario, Canada
- N2L 3G1
- DOCUMENT
- ENGINEER
- REVIEWER
- MODIFIED
- SHEET
- OF
- (in symbol CAP_2.2uF_25V_0603) 0603
- (in symbol CAP_4.7uF_25V_1210) 1210
- (in symbol RES_22.1kΩ_0603_1%) 0603
- (in symbol RES_51kΩ_0603_1%) 0603
- (in symbol RES_100kΩ_0603_1%) 0603
- (in symbol RES_150kΩ_0603_1%) 0603

### Library data of the parts
C8 C16 C19 = CAP_0.1uF_50V_0603: CAP CER 0.1UF 50V X7R 0603; Manufacturer Part Number 1: CC0603KRX7R9BB104; Manufacturer 1: Yageo; Package/Footprint: 0603; Supplier Part Number 1: 311-1344-1-ND; Supplier 1: Digi-Key; Mounting Type: SMD; Dielectric: X7R
C9 C10 C18 = CAP_2.2uF_25V_0603: CAP CER 2.2UF 25V X5R 0603; Manufacturer Part Number 1: C1608X5R1E225K080AB; Manufacturer 1: TDK Corporation; Dielectric: 5; Supplier Part Number 1: 445-5964-1-ND; Supplier 1: Digi-Key
C11 = CAP_4.7uF_25V_1210: CAP CER 4.7UF 25V X8L 1210; Manufacturer 1: Murata Electronics; Manufacturer Part Number 1: GCJ32EL81E475KA01L; Supplier 1: Digi-Key; Supplier Part Number 1: 490-16465-1-ND; Dielectric: X8L
C12 = CAP_22uF_25V_1210: CAP CER 22UF 25V X7R 1210; Manufacturer 1: Murata Electronics; Manufacturer Part Number 1: GRM32ER71E226ME15K; Package/Footprint: 1210; Supplier 1: Digi-Key; Supplier Part Number 1: 490-14682-1-ND; Mounting Type: SMD
C13 = CAP_10uF_63V_1210: as C6 on sheet Motor Power Switch; Mounting Type: SMD; Package: 1210; Dielectric: X7R; Supplier 1: Digikey; Supplier Part Number 1: 1276-7053-6-ND
C14 = CAP_1uF_100V_1206: CAP CER 1UF 100V X7R 1206; Supplier 1: Digi-Key; Mounting Type: SMD; Package: 1206; Supplier Part Number 1: 490-16468-1-ND
C15 = CAP_0.1uF_100V_0805: as C1 on sheet Ideal Diode; Package: 0805; Supplier 1: Digi-Key; Supplier Part Number 1: 445-1418-1-ND
C17 = CAP_22uF_10V_0603: CAP CER 22UF 10V X5R 0603; Manufacturer: Taiyo Yuden; Manufacturer Part Number: LMK107BBJ226MA-T; Supplier 1: Digi-Key; Supplier Part Number 1: 587-4913-1-ND; Package: 0603
D3 = DIO_SCHOTTKY_60V_5A: DIODE SCHOTTKY 60V 5A SMA; Manufacturer 1: Diodes Incorporated; Manufacturer Part Number 1: SDT5A60SA-13; Forward Voltage: 520mV @5A; Mounting Type: SMD; Package/Footprint: SMA; Supplier 1: Digi-Key; Supplier Part Number 1: B260S1F-7DICT-ND
L1 = IND_10uH_4.3A: FIXED IND 10UH 4.3A 28 MOHM SMD; Manufacturer 1: Murata Electronics; Manufacturer Part Number 1: #B966AS-100M=P3; Supplier Part Number 1: 490-14123-1-ND; Supplier 1: Digi-Key; Mounting Type: SMD; Package/Footprint: SMD
L2 = IND_10uH_1.3A: FIXED IND 12UH 1.3A 135 MOHM SMD; Manufacturer 1: Abracon LLC; Manufacturer Part Number 1: ASPI-4030S-120M-T; Supplier Part Number 1: 535-ASPI-4030S-120M-TCT-ND; Supplier 1: Digi-Key; Mounting Type: SMD; Package/Footprint: SMD
LED1 LED2 = LED_GREEN_0805: LED GREEN DIFFUSED 0805 SMD; Manufacturer 1: OSRAM; Manufacturer Part Number 1: LG R971-KN-1; Forward Voltage Drop: 2.2V; Package/Footprint: 0805; Supplier Part Number 1: 475-1410-1-ND; Supplier 1: Digi-Key; Mounting Type: SMD
Q5 = NMOS_20V_2.6A: as Q11 on sheet Motor Power Switch; Supplier 1: Digi-Key; Supplier Part Number 1: SI2302CDS-T1-E3CT-ND
R8 = RES_150kΩ_0603_1%: RES 150K OHM 1% 1/10W 0603; Manufacturer 1: Yageo; Manufacturer Part Number 1: RC0603FR-07150KL; Supplier Part Number 1: 311-150KHRCT-ND; Supplier 1: Digi-Key; Mounting Type: Surface Mount
R9 R10 R12 R18 = RES_10kΩ_0603_1%: as R5 on sheet Ideal Diode; Supplier Part Number 1: RNCP0603FTD10K0CT-ND; Supplier 1: Digi-Key; Mounting Type: SMD; Package: 0603
R11 = RES_23.2kΩ_0603_1%: RES 23.2K OHM 1% 1/10W 0603; Manufacturer Part Number 1: RMCF0603FT23K2; Manufacturer 1: Stackpole Electronics Inc; Package/Footprint: 0603; Supplier 1: Digi-Key; Supplier Part Number 1: RMCF0603FT23K2CT-ND
R13 R16 = RES_51kΩ_0603_1%: RES 51K OHM 1% 1/10W 0603; Manufacturer Part Number 1: RC0603FR-0751KL; Manufacturer 1: Yageo; Supplier 1: Digi-Key; Supplier Part Number 1: 311-51.0KHRCT-ND
R14 = RES_22.1kΩ_0603_1%: RES 22.1K OHM 1% 1/10W 0603; Manufacturer 1: Stackpole Electronics Inc; Manufacturer Part Number 1: RMCF0603FT22K1; Supplier Part Number 1: RMCF0603FT22K1CT-ND; Supplier 1: Digi-Key
R15 = RES_100kΩ_0603_1%: RES 100K OHM 1% 1/10W 0603; Manufacturer Part Number 1: RC0603FR-07100KL; Manufacturer 1: Yageo; Supplier 1: Digi-Key; Supplier Part Number 1: 311-100KHRCT-ND
R17 = RES_9.53kΩ_0603_1%: as R7 on sheet Motor Power Switch; Supplier Part Number 1: 311-9.53KHRCT-ND; Supplier 1: Digi-Key; Mounting Type: SMD; Package: 0603
R19 = RES_1.1kΩ_0603_1%: RES 1.1K OHM 1% 1/10W 0603; Manufacturer 1: Yageo; Manufacturer Part Number 1: RC0603FR-071K1L; Supplier Part Number 1: 311-1.10KHRCT-ND; Supplier 1: Digi-Key; Mounting Type: SMD; Package: 0603
TP18 TP19 = TESTPOINT_KEYSTONE_LOOP: PC TEST POINT MINIATURE; Manufacturer 1: Keystone Electronics; Manufacturer Part Number 1: 5019; Package/Footprint: SMD; Supplier 1: Digi-Key; Mounting Type: SMD; Supplier Part Number 1: 36-5019CT-ND
TP32 = TESTPOINT_1MM_CIRCLE: TESTPOINT 1MM CIRCLE
U3 = LV14360PDDAR: IC REG BUCK ADJ 3A 8SOPWR; Manufacturer 1: Texas Instruments; Package/Footprint: 8-PowerSOIC; Manufacturer Part Number 1: LV14360PDDAR; Supplier 1: Digikey; Supplier Part Number 1: 296-LV14360PDDARCT-ND
U4 = TPS560430X3FDBVT: IC REG BUCK 3.3V 600MA SOT23-6; Manufacturer 1: Texas Instruments; Package/Footprint: SOT-23-6; Manufacturer Part Number 1: TPS560430X3FDBVT; Supplier 1: Digikey; Supplier Part Number 1: 296-53224-1-ND

## Sheet HV Power Stage.SchDoc
size A4; Engineer: Farris Matar; Organization: TESLA Motors, INC; Address1: 3500 Deer Creek Road; Address2: Palo Alto, CA; Address4: U.S.A.; SheetNumber: 7; SheetTotal: 14
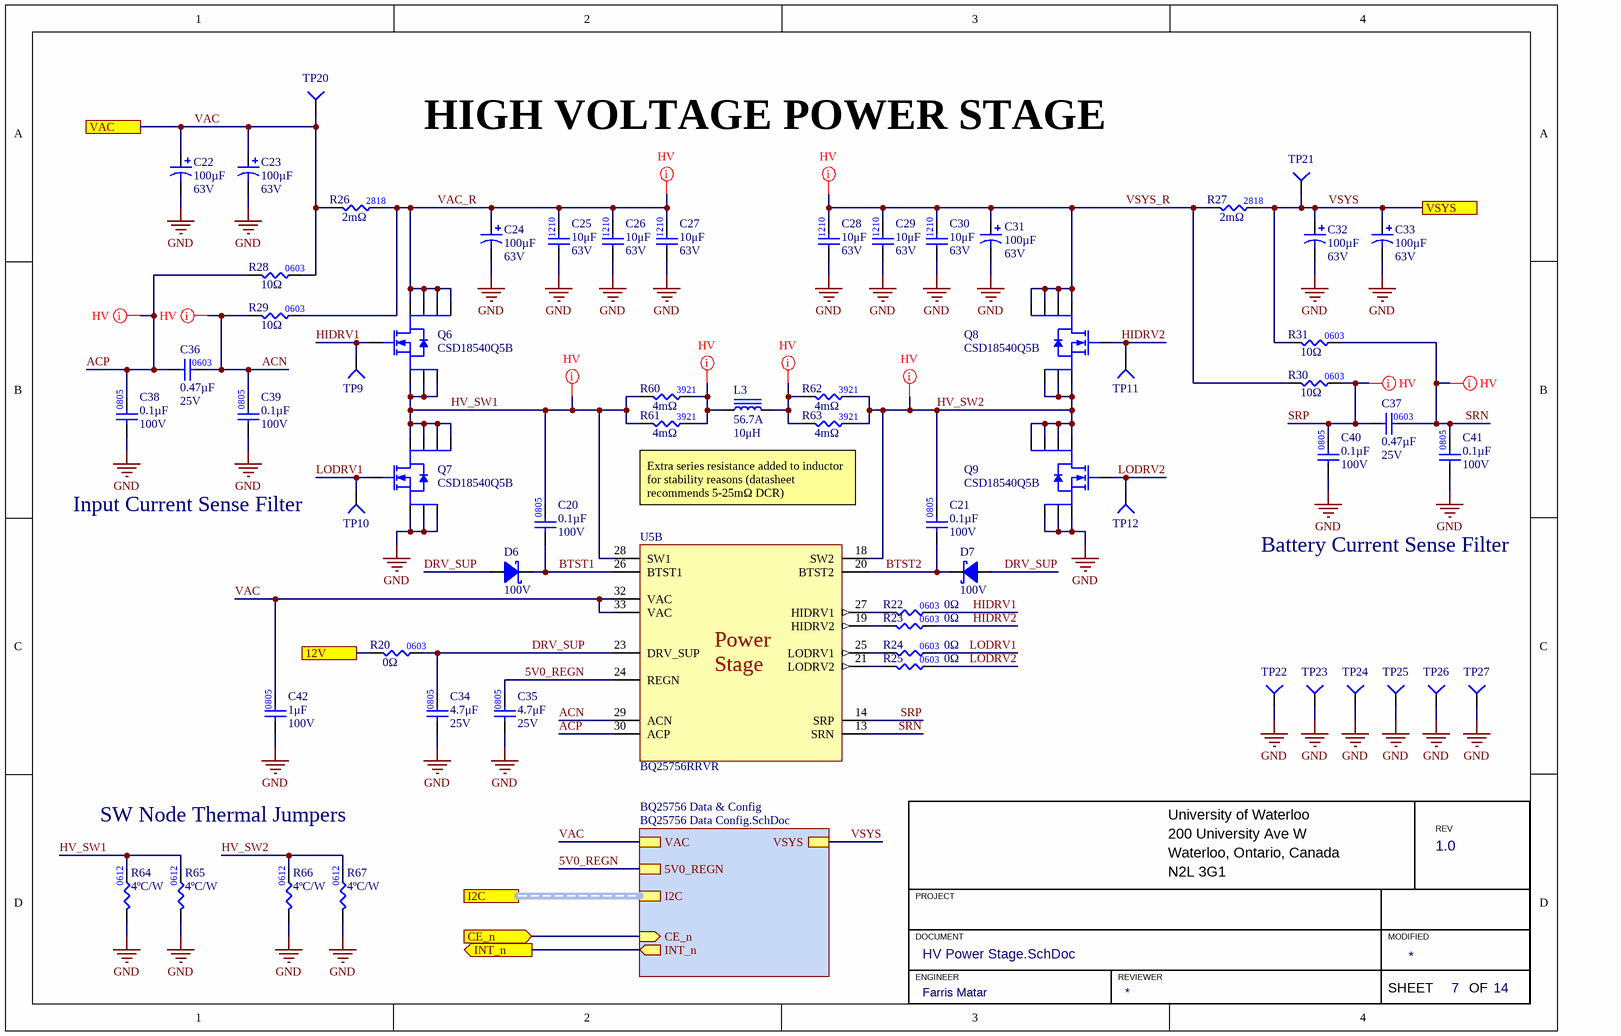
[diagram p5: HV Power Stage.SchDoc]

### Parts
C20  value 0.1µF  Voltage Rating: 100V  [CAP0805]  (hidden comment: CAP_0.1uF_100V_0805)
C21  value 0.1µF  Voltage Rating: 100V  [CAP0805]  (hidden comment: CAP_0.1uF_100V_0805)
C22  value 100µF  Voltage Rating: 63V  [RADIAL_KEMET_A781]  (hidden comment: CAP_100uF_63V_ALUMHYB)
C23  value 100µF  Voltage Rating: 63V  [RADIAL_KEMET_A781]  (hidden comment: CAP_100uF_63V_ALUMHYB)
C24  value 100µF  Voltage Rating: 63V  [RADIAL_KEMET_A781]  (hidden comment: CAP_100uF_63V_ALUMHYB)
C25  value 10μF  Voltage Rating: 63V  [CAP1210]  (hidden comment: CAP_10uF_63V_1210)
C26  value 10μF  Voltage Rating: 63V  [CAP1210]  (hidden comment: CAP_10uF_63V_1210)
C27  value 10μF  Voltage Rating: 63V  [CAP1210]  (hidden comment: CAP_10uF_63V_1210)
C28  value 10μF  Voltage Rating: 63V  [CAP1210]  (hidden comment: CAP_10uF_63V_1210)
C29  value 10μF  Voltage Rating: 63V  [CAP1210]  (hidden comment: CAP_10uF_63V_1210)
C30  value 10μF  Voltage Rating: 63V  [CAP1210]  (hidden comment: CAP_10uF_63V_1210)
C31  value 100µF  Voltage Rating: 63V  [RADIAL_KEMET_A781]  (hidden comment: CAP_100uF_63V_ALUMHYB)
C32  value 100µF  Voltage Rating: 63V  [RADIAL_KEMET_A781]  (hidden comment: CAP_100uF_63V_ALUMHYB)
C33  value 100µF  Voltage Rating: 63V  [RADIAL_KEMET_A781]  (hidden comment: CAP_100uF_63V_ALUMHYB)
C34  value 4.7μF  Voltage Rating: 25V  [CAP0805]  (hidden comment: CAP_4.7uF_25V_0805)
C35  value 4.7μF  Voltage Rating: 25V  [CAP0805]  (hidden comment: CAP_4.7uF_25V_0805)
C36  value 0.47µF  Voltage Rating: 25V  [CAP0603]  (hidden comment: CAP_0.47uF_25V_0603)
C37  value 0.47µF  Voltage Rating: 25V  [CAP0603]  (hidden comment: CAP_0.47uF_25V_0603)
C38  value 0.1µF  Voltage Rating: 100V  [CAP0805]  (hidden comment: CAP_0.1uF_100V_0805)
C39  value 0.1µF  Voltage Rating: 100V  [CAP0805]  (hidden comment: CAP_0.1uF_100V_0805)
C40  value 0.1µF  Voltage Rating: 100V  [CAP0805]  (hidden comment: CAP_0.1uF_100V_0805)
C41  value 0.1µF  Voltage Rating: 100V  [CAP0805]  (hidden comment: CAP_0.1uF_100V_0805)
C42  value 1μF  Voltage Rating: 100V  [CAP0805]  (hidden comment: CAP_1uF_100V_0805)
D6  Vr (Max): 100V  [SOD-123_FLAT]  (hidden comment: DIO_SCHOTTKY_100V_2A)
D7  Vr (Max): 100V  [SOD-123_FLAT]  (hidden comment: DIO_SCHOTTKY_100V_2A)
L3  Current Rating: 56.7A  Inductance: 10μH  [IND_WURTH_HCFT_TH]  (hidden comment: IND_10uH_56.7A)
Q6  Manufacturer Part Number 1: CSD18540Q5B  [DFN5060]  (hidden comment: NMOS_60V_100A_TI)
Q7  Manufacturer Part Number 1: CSD18540Q5B  [DFN5060]  (hidden comment: NMOS_60V_100A_TI)
Q8  Manufacturer Part Number 1: CSD18540Q5B  [DFN5060]  (hidden comment: NMOS_60V_100A_TI)
Q9  Manufacturer Part Number 1: CSD18540Q5B  [DFN5060]  (hidden comment: NMOS_60V_100A_TI)
R20  value 0Ω  [RES0603]  (hidden comment: RES_0Ω_0603)
R22  value 0Ω  [RES0603]  (hidden comment: RES_0Ω_0603)
R23  value 0Ω  [RES0603]  (hidden comment: RES_0Ω_0603)
R24  value 0Ω  [RES0603]  (hidden comment: RES_0Ω_0603)
R25  value 0Ω  [RES0603]  (hidden comment: RES_0Ω_0603)
R26  value 2mΩ  [RES2812_VISHAY]  (hidden comment: RES_2mΩ_2818_1%)
R27  value 2mΩ  [RES2812_VISHAY]  (hidden comment: RES_2mΩ_2818_1%)
R28  value 10Ω  [RES0603]  (hidden comment: RES_10Ω_0603_1%)
R29  value 10Ω  [RES0603]  (hidden comment: RES_10Ω_0603_1%)
R30  value 10Ω  [RES0603]  (hidden comment: RES_10Ω_0603_1%)
R31  value 10Ω  [RES0603]  (hidden comment: RES_10Ω_0603_1%)
R60  value 4mΩ  [RES3921]  (hidden comment: RES_4mΩ_3921_1%)
R61  value 4mΩ  [RES3921]  (hidden comment: RES_4mΩ_3921_1%)
R62  value 4mΩ  [RES3921]  (hidden comment: RES_4mΩ_3921_1%)
R63  value 4mΩ  [RES3921]  (hidden comment: RES_4mΩ_3921_1%)
R64  value 4ºC/W  [RES0612]  (hidden comment: THERM_JMP_4C_0612)
R65  value 4ºC/W  [RES0612]  (hidden comment: THERM_JMP_4C_0612)
R66  value 4ºC/W  [RES0612]  (hidden comment: THERM_JMP_4C_0612)
R67  value 4ºC/W  [RES0612]  (hidden comment: THERM_JMP_4C_0612)
TP9  TESTPOINT_1MM_CIRCLE  [TESTPOINT_CIRCLE_1MM]  (value not drawn)  (no BOM)
TP10  TESTPOINT_1MM_CIRCLE  [TESTPOINT_CIRCLE_1MM]  (value not drawn)  (no BOM)
TP11  TESTPOINT_1MM_CIRCLE  [TESTPOINT_CIRCLE_1MM]  (value not drawn)  (no BOM)
TP12  TESTPOINT_1MM_CIRCLE  [TESTPOINT_CIRCLE_1MM]  (value not drawn)  (no BOM)
TP20  TESTPOINT_KEYSTONE_LOOP  [KEYSTONE_5019]  (value not drawn)
TP21  TESTPOINT_KEYSTONE_LOOP  [KEYSTONE_5019]  (value not drawn)
TP22  TESTPOINT_KEYSTONE_LOOP  [KEYSTONE_5019]  (value not drawn)
TP23  TESTPOINT_KEYSTONE_LOOP  [KEYSTONE_5019]  (value not drawn)
TP24  TESTPOINT_KEYSTONE_LOOP  [KEYSTONE_5019]  (value not drawn)
TP25  TESTPOINT_KEYSTONE_LOOP  [KEYSTONE_5019]  (value not drawn)
TP26  TESTPOINT_KEYSTONE_LOOP  [KEYSTONE_5019]  (value not drawn)
TP27  TESTPOINT_KEYSTONE_LOOP  [KEYSTONE_5019]  (value not drawn)
U5  BQ25756RRVR  [TI_36-VQFN]  (part B of 3)

### Sub-sheets
BQ25756 Data & Config = BQ25756 Data Config.SchDoc: VAC, VSYS, I2C (harness I2C), 5V0_REGN, INT_n (out), CE_n (in)

### Ports
12V, CE_n (in), I2C (harness I2C), INT_n (out), VAC, VSYS

### Nets
12V: R20.1 ; port 12V
GND: C22.2 C23.2 C24.2 C25.1 C26.1 C27.1 C28.1 C29.1 C30.1 C31.2 C32.2 C33.2 C34.1 C35.1 C38.1 C39.1 C40.1 C41.1 C42.1 Q7.1(Source) Q7.2(Source) Q7.3(Source) Q9.1(Source) Q9.2(Source) Q9.3(Source) R64.1 R65.1 R66.1 R67.1 TP22.1(=value) TP23.1(=value) TP24.1(=value) TP25.1(=value) TP26.1(=value) TP27.1(=value)
VAC: C22.1 C23.1 C42.2 R26.1 R28.2 TP20.1(=value) U5.32(VAC) U5.33(VAC) ; port VAC, sheet BQ25756 Data & Config/VAC
VSYS: C32.1 C33.1 R27.2 R31.1 TP21.1(=value) ; port VSYS, sheet BQ25756 Data & Config/VSYS
5V0_REGN: C35.2 U5.24(REGN) ; sheet BQ25756 Data & Config/5V0_REGN
ACN: C36.2 C39.2 R29.1 U5.29(ACN)
ACP: C36.1 C38.2 R28.1 U5.30(ACP)
BTST1: C20.1 D6.2(Cathode) U5.26(BTST1)
BTST2: C21.1 D7.2(Cathode) U5.20(BTST2)
CE_n: port CE_n, sheet BQ25756 Data & Config/CE_n
DRV_SUP: C34.2 D6.1(Anode) D7.1(Anode) R20.2 U5.23(DRV_SUP)
HIDRV1: Q6.4(Gate) R22.2 TP9.1(=value)
HIDRV2: Q8.4(Gate) R23.2 TP11.1(=value)
HV_SW1: C20.2 Q6.1(Source) Q6.2(Source) Q6.3(Source) Q7.5(Drain) Q7.6(Drain) Q7.7(Drain) Q7.8(Drain) R60.1 R61.1 R64.2 R65.2 U5.28(SW1)
HV_SW2: C21.2 Q8.1(Source) Q8.2(Source) Q8.3(Source) Q9.5(Drain) Q9.6(Drain) Q9.7(Drain) Q9.8(Drain) R62.2 R63.2 R66.2 R67.2 U5.18(SW2)
INT_n: port INT_n, sheet BQ25756 Data & Config/INT_n
LODRV1: Q7.4(Gate) R24.2 TP10.1(=value)
LODRV2: Q9.4(Gate) R25.2 TP12.1(=value)
SRN: C37.2 C41.2 R31.2 U5.13(SRN)
SRP: C37.1 C40.2 R30.2 U5.14(SRP)
VAC_R: C24.1 C25.2 C26.2 C27.2 Q6.5(Drain) Q6.6(Drain) Q6.7(Drain) Q6.8(Drain) R26.2 R29.2
VSYS_R: C28.2 C29.2 C30.2 C31.1 Q8.5(Drain) Q8.6(Drain) Q8.7(Drain) Q8.8(Drain) R27.1 R30.1
NetL3_1: L3.1 R60.2 R61.2
NetL3_2: L3.2 R62.1 R63.1
NetR22_1: R22.1 U5.27(HIDRV1)
NetR23_1: R23.1 U5.19(HIDRV2)
NetR24_1: R24.1 U5.25(LODRV1)
NetR25_1: R25.1 U5.21(LODRV2)

### Buses and harness runs
harness port I2C = sheet BQ25756 Data & Config/I2C

### Layout directives
net class HV: ACN, ACP, HV_SW1, HV_SW2, NetL3_1, NetL3_2, SRN, SRP, VAC_R, VSYS_R

### Notes on the sheet
- HIGH VOLTAGE POWER STAGE
- (near TP10) Input Current Sense Filter
- Extra series resistance added to inductor for stability reasons (datasheet recommends 5-25mΩ DCR)
- Battery Current Sense Filter
- SW Node Thermal Jumpers
- University of Waterloo
- 200 University Ave W
- REV
- PROJECT
- Waterloo, Ontario, Canada
- N2L 3G1
- DOCUMENT
- ENGINEER
- REVIEWER
- MODIFIED
- SHEET
- OF
- (in symbol BQ25756RRVR, part B) Power Stage
- (in symbol CAP_1uF_100V_0805) 0805
- (in symbol CAP_4.7uF_25V_0805) 0805
- (in symbol RES_2mΩ_2818_1%) 2818
- (in symbol RES_4mΩ_3921_1%) 3921
- (in symbol RES_10Ω_0603_1%) 0603

### Library data of the parts
C20 C21 C38-C41 = CAP_0.1uF_100V_0805: as C1 on sheet Ideal Diode; Package: 0805; Supplier 1: Digi-Key; Supplier Part Number 1: 445-1418-1-ND
C22-C24 C31-C33 = CAP_100uF_63V_ALUMHYB: CAP ALUMHYB 100UF 20% 63V SMD; Manufacturer 1: KEMET; Manufacturer Part Number 1: A781MS107M1JLAS030; Package/Footprint: Radial; Mounting Type: SMD; Supplier 1: Digikey; Supplier Part Number 1: 399-A781MS107M1JLAS030CT-ND
C25-C30 = CAP_10uF_63V_1210: as C6 on sheet Motor Power Switch; Mounting Type: SMD; Package: 1210; Dielectric: X7R; Supplier 1: Digikey; Supplier Part Number 1: 1276-7053-6-ND
C34 C35 = CAP_4.7uF_25V_0805: CAP CER 4.7UF 25V X7R 0805; Manufacturer 1: Taiyo Yuden; Manufacturer Part Number 1: TMK212AB7475KG-T; Supplier 1: Digi-Key; Supplier Part Number 1: 587-2990-1-ND; Dielectric: X7R
C36 C37 = CAP_0.47uF_25V_0603: CAP CER 0.47UF 25V X7R 0603; Manufacturer 1: KEMET; Manufacturer Part Number 1: C0603C474K3RAC7867; Package: 0603; Supplier 1: Digi-Key; Supplier Part Number 1: 399-11934-1-ND
C42 = CAP_1uF_100V_0805: CAP CER 1UF 100V X7R 0805; Manufacturer 1: KYOCERA AVX; Manufacturer Part Number 1: 08051C105K4Z2A; Supplier 1: Digi-Key; Supplier Part Number 1: 478-KAF21KR72A105KUCT-ND; Dielectric: X7R
D6 D7 = DIO_SCHOTTKY_100V_2A: DIODE SCHOTTKY 100V 2A SOD123F; Manufacturer 1: STMicroelectronics; Manufacturer Part Number 1: STPSH100ZF; Package/Footprint: SOD-123F; Supplier 1: Digi-Key; Supplier Part Number 1: 497-17152-2-ND; Mounting Type: SMD; Verified: No
L3 = IND_10uH_56.7A: FIXED IND 10UH 56.7A 1.2 MOHM TH; Manufacturer 1: Würth Elektronik; Manufacturer Part Number 1: 7443763540100; DC Resistance (DCR): 1.2mΩ; Saturation Current: 62A; Supplier 1: Digikey; Supplier Part Number 1: 732-13640-ND
Q6-Q9 = NMOS_60V_100A_TI: MOSFET N-CH 60V 100A 8VSON; Manufacturer 1: Texas Instruments; FET Type: N-Channel; Vgs (Max): 20V; Power Dissipation (Max): 3.1W; Supplier 1: Digi-Key; Supplier Part Number 1: 296-41076-1-ND; Vdss: 60V; Supplier Device Package: 8-PowerTDFN; Id: 100A
R20 R22-R25 = RES_0Ω_0603: as R1 on sheet Ideal Diode; Supplier Part Number 1: 311-0.0GRCT-ND; Supplier 1: Digi-Key; Mounting Type: SMD; Package: 0603
R26 R27 = RES_2mΩ_2818_1%: RES 0.002 OHM 1% 10W 2818; Manufacturer 1: Vishay Dale; Manufacturer Part Number 1: WSHP28182L000FEA; Supplier 1: Digi-Key; Supplier Part Number 1: 541-3273-1-ND
R28-R31 = RES_10Ω_0603_1%: RES 10 OHM 1% 1/10W 0603; Manufacturer 1: Vishay Dale; Manufacturer Part Number 1: CRCW060310R0FKEA; Supplier Part Number 1: 541-10.0HCT-ND; Supplier 1: Digi-Key
R60-R63 = RES_4mΩ_3921_1%: RES 0.004 OHM 1% 5W 3921; Manufacturer 1: Thin Film Technology Corp.; Manufacturer Part Number 1: D1CSA3921FR004F-T3; Supplier 1: DigiKey; Supplier Part Number 1: 4463-D1CSA3921FR004F-T3DKR-ND
R64-R67 = THERM_JMP_4C_0612: THERMAL JUMPER 0612 30 MIL LEAD-; Manufacturer 1: Vishay Dale Thin Film; Manufacturer Part Number 1: THJP0612AST1; Supplier Part Number 1: 764-THJP0612AST1CT-ND; Supplier 1: Digi-Key; Mounting Type: SMD; Package: 0612
TP9-TP12 = TESTPOINT_1MM_CIRCLE: TESTPOINT 1MM CIRCLE
TP20-TP27 = TESTPOINT_KEYSTONE_LOOP: as TP18 on sheet LV Power; Supplier 1: Digi-Key; Mounting Type: SMD; Supplier Part Number 1: 36-5019CT-ND
U5 = BQ25756RRVR: IC BATT CHARGER BUCK-BOOST CTRLR; Manufacturer 1: Texas Instruments; Package/Footprint: 36-VQFN; Supplier 1: Digikey; Supplier Part Number 1: 296-BQ25756RRVRCT-ND; Manufacturer Part Number 1: BQ25756RRVR

## Sheet BQ25756 Data Config.SchDoc
size A4; Engineer: Farris Matar; Organization: TESLA Motors, INC; Address1: 3500 Deer Creek Road; Address2: Palo Alto, CA; Address4: U.S.A.; SheetNumber: 8; SheetTotal: 13
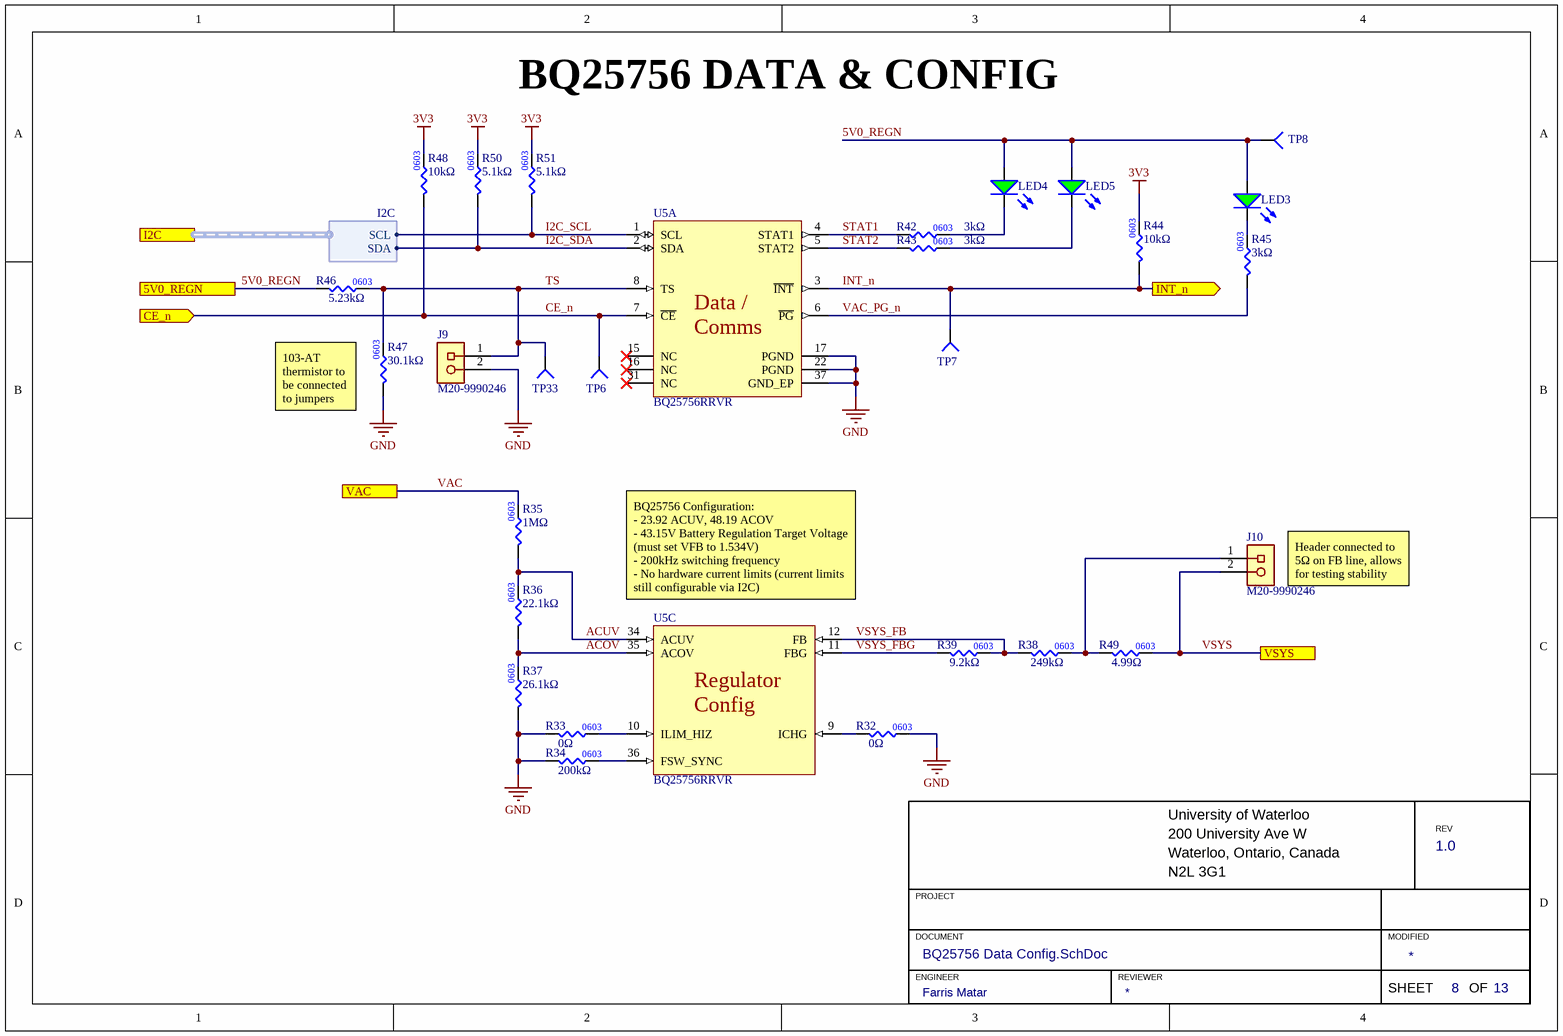
[diagram p6: BQ25756 Data Config.SchDoc]

### Parts
J9  Manufacturer Part Number 1: M20-9990246  [HDR1X2]  (hidden comment: HEADER 2x1)
J10  Manufacturer Part Number 1: M20-9990246  [HDR1X2]  (hidden comment: HEADER 2x1)
LED3  LED_GREEN_0805  [LED_0805_GREEN]  (value not drawn)
LED4  LED_GREEN_0805  [LED_0805_GREEN]  (value not drawn)
LED5  LED_GREEN_0805  [LED_0805_GREEN]  (value not drawn)
R32  value 0Ω  [RES0603]  (hidden comment: RES_0Ω_0603)
R33  value 0Ω  [RES0603]  (hidden comment: RES_0Ω_0603)
R34  value 200kΩ  [RES0603]  (hidden comment: RES_200kΩ_0603_1%)
R35  value 1MΩ  [RES0603]  (hidden comment: RES_1MΩ_0603_1%)
R36  value 22.1kΩ  [RES0603]  (hidden comment: RES_22.1kΩ_0603_1%)
R37  value 26.1kΩ  [RES0603]  (hidden comment: RES_26.1kΩ_0603_1%)
R38  value 249kΩ  [RES0603]  (hidden comment: RES_249kΩ_0603_1%)
R39  value 9.2kΩ  [RES0603]  (hidden comment: RES_9.2kΩ_0603_0.1%)
R42  value 3kΩ  [RES0603]  (hidden comment: RES_3kΩ_0603_1%)
R43  value 3kΩ  [RES0603]  (hidden comment: RES_3kΩ_0603_1%)
R44  value 10kΩ  [RES0603]  (hidden comment: RES_10kΩ_0603_1%)
R45  value 3kΩ  [RES0603]  (hidden comment: RES_3kΩ_0603_1%)
R46  value 5.23kΩ  [RES0603]  (hidden comment: RES_5.23kΩ_0603_0.1%)
R47  value 30.1kΩ  [RES0603]  (hidden comment: RES_30.1kΩ_0603_0.1%)
R48  value 10kΩ  [RES0603]  (hidden comment: RES_10kΩ_0603_1%)
R49  value 4.99Ω  [RES0603]  (hidden comment: RES_4.99Ω_0603_1%)
R50  value 5.1kΩ  [RES0603]  (hidden comment: RES_5.1kΩ_0603_1%)
R51  value 5.1kΩ  [RES0603]  (hidden comment: RES_5.1kΩ_0603_1%)
TP6  TESTPOINT_1MM_CIRCLE  [TESTPOINT_CIRCLE_1MM]  (value not drawn)  (no BOM)
TP7  TESTPOINT_1MM_CIRCLE  [TESTPOINT_CIRCLE_1MM]  (value not drawn)  (no BOM)
TP8  TESTPOINT_1MM_SQUARE  [TESTPOINT_SQUARE_1MM]  (value not drawn)  (no BOM)
TP33  TESTPOINT_1MM_CIRCLE  [TESTPOINT_CIRCLE_1MM]  (value not drawn)  (no BOM)
U5  BQ25756RRVR  [TI_36-VQFN]  (parts A,C of 3)

### Ports
5V0_REGN, CE_n (in), I2C (harness I2C), INT_n (out), VAC, VSYS

### Harnesses
I2C: SCL, SDA

### Nets
3V3: R44.2 R48.2 R50.2 R51.2
GND: J9.2 R32.2 R33.1 R34.1 R37.1 R47.1 U5.17(PGND) U5.22(PGND) U5.37(GND_EP)
VAC: R35.2 ; port VAC
VSYS: J10.2 R49.2 ; port VSYS
5V0_REGN: LED3.1(A) LED4.1(A) LED5.1(A) R46.1 TP8.1(=value) ; port 5V0_REGN
ACOV: R36.1 R37.2 U5.35(ACOV)
ACUV: R35.1 R36.2 U5.34(ACUV)
CE_n: R48.1 TP6.1(=value) U5.7(~{CE}) ; port CE_n
I2C_SCL: R51.1 U5.1(SCL) ; port I2C.SCL  [project net I2C.SCL]
I2C_SDA: R50.1 U5.2(SDA) ; port I2C.SDA  [project net I2C.SDA]
INT_n: R44.1 TP7.1(=value) U5.3(~{INT}) ; port INT_n
STAT1: R42.1 U5.4(STAT1)
STAT2: R43.1 U5.5(STAT2)
TS: J9.1(VCC) R46.2 R47.2 TP33.1(=value) U5.8(TS)
VAC_PG_n: R45.1 U5.6(~{PG})
VSYS_FB: R38.1 R39.2 U5.12(FB)
VSYS_FBG: R39.1 U5.11(FBG)
NetJ10_1: J10.1(VCC) R38.2 R49.1
NetLED3_2: LED3.2(K) R45.2
NetLED4_2: LED4.2(K) R42.2
NetLED5_2: LED5.2(K) R43.2
NetR32_1: R32.1 U5.9(ICHG)
NetR33_2: R33.2 U5.10(ILIM_HIZ)
NetR34_2: R34.2 U5.36(FSW_SYNC)

Not connected (* = marked no-connect by the designer): U5 15(NC)* 16(NC)* 31(NC)*

### Notes on the sheet
- BQ25756 DATA & CONFIG
- (near R47) 103-AT thermistor to be connected to jumpers
- (near J10) Header connected to 5Ω on FB line, allows for testing stability
- (near U5) BQ25756 Configuration:
  - 23.92 ACUV, 48.19 ACOV
  - 43.15V Battery Regulation Target Voltage (must set VFB to 1.534V)
  - 200kHz switching frequency
  - No hardware current limits (current limits still configurable via I2C)
- University of Waterloo
- 200 University Ave W
- REV
- PROJECT
- Waterloo, Ontario, Canada
- N2L 3G1
- DOCUMENT
- ENGINEER
- REVIEWER
- MODIFIED
- SHEET
- OF
- (in symbol BQ25756RRVR, part A) Data / / Comms
- (in symbol BQ25756RRVR, part C) Regulator / Config
- (in symbol RES_3kΩ_0603_1%) 0603
- (in symbol RES_9.2kΩ_0603_0.1%) 0603
- (in symbol RES_22.1kΩ_0603_1%) 0603
- (in symbol RES_26.1kΩ_0603_1%) 0603
- (in symbol RES_249kΩ_0603_1%) 0603

### Library data of the parts
J9 J10 = HEADER 2x1: Manufacturer 1: Harwin Inc.; Package/Footprint: TH; Mounting Type: TH; Supplier 1: Digi-Key; Supplier Part Number 1: 952-2262-ND
LED3-LED5 = LED_GREEN_0805: as LED1 on sheet LV Power; Supplier Part Number 1: 475-1410-1-ND; Supplier 1: Digi-Key; Mounting Type: SMD
R32 R33 = RES_0Ω_0603: as R1 on sheet Ideal Diode; Supplier Part Number 1: 311-0.0GRCT-ND; Supplier 1: Digi-Key; Mounting Type: SMD; Package: 0603
R34 = RES_200kΩ_0603_1%: RES 200K OHM 1% 1/10W 0603; Manufacturer 1: YAGEO; Manufacturer Part Number 1: RC0603FR-13200KL; Package/Footprint: 0603; Supplier Part Number 1: 13-RC0603FR-13200KLCT-ND; Supplier 1: Digi-Key; Mounting Type: SMD
R35 = RES_1MΩ_0603_1%: RES 1M OHM 1% 1/10W 0603; Manufacturer 1: YAGEO; Manufacturer Part Number 1: RC0603FR-071ML; Supplier Part Number 1: 311-1.00MHRCT-ND; Supplier 1: Digi-Key; Mounting Type: SMD; Package: 0603
R36 = RES_22.1kΩ_0603_1%: as R14 on sheet LV Power; Supplier 1: Digi-Key; Supplier Part Number 1: RMCF0603FT22K1CT-ND
R37 = RES_26.1kΩ_0603_1%: RES 26.1K OHM 1% 1/10W 0603; Manufacturer 1: Yageo; Manufacturer Part Number 1: RC0603FR-0726K1L; Supplier Part Number 1: 311-26.1KHRCT-ND; Supplier 1: Digi-Key
R38 = RES_249kΩ_0603_1%: RES 249K OHM 1% 1/10W 0603; Manufacturer 1: Stackpole Electronics Inc; Manufacturer Part Number 1: RMCF0603FT249K; Supplier Part Number 1: RMCF0603FT249KCT-ND; Supplier 1: Digi-Key
R39 = RES_9.2kΩ_0603_0.1%: RES 9.2K OHM 0.1% 1/10W 0603; Manufacturer 1: YAGEO; Manufacturer Part Number 1: RT0603BRD079K2L; Supplier Part Number 1: 13-RT0603BRD079K2LCT-ND; Supplier 1: Digi-Key
R42 R43 R45 = RES_3kΩ_0603_1%: RES 3K OHM 1% 1/10W 0603; Manufacturer 1: Yageo; Manufacturer Part Number 1: RC0603FR-073KL; Supplier Part Number 1: 311-3.00KHRCT-ND; Supplier 1: Digi-Key
R44 R48 = RES_10kΩ_0603_1%: as R5 on sheet Ideal Diode; Supplier Part Number 1: RNCP0603FTD10K0CT-ND; Supplier 1: Digi-Key; Mounting Type: SMD; Package: 0603
R46 = RES_5.23kΩ_0603_0.1%: RES SMD 5.23KOHM 0.1% 1/10W 0603; Manufacturer 1: YAGEO; Manufacturer Part Number 1: RT0603BRE075K23L; Mounting Type: SMD; Package: 0603; Supplier 1: Digi-Key; Supplier Part Number 1: YAG4758CT-ND
R47 = RES_30.1kΩ_0603_0.1%: RES SMD 30.1KOHM 0.1% 1/10W 0603; Manufacturer 1: YAGEO; Manufacturer Part Number 1: RT0603BRD0730K1L; Mounting Type: SMD; Package: 0603; Supplier 1: Digi-Key; Supplier Part Number 1: YAG1631CT-ND
R49 = RES_4.99Ω_0603_1%: RES 4.99 OHM 1% 1/10W 0603; Manufacturer 1: YAGEO; Manufacturer Part Number 1: RC0603FR-074R99L; Mounting Type: SMD; Package: 0603; Supplier 1: Digikey; Supplier Part Number 1: 311-4.99HRCT-ND
R50 R51 = RES_5.1kΩ_0603_1%: RES 5.1K OHM 1% 1/10W 0603; Manufacturer 1: YAGEO; Manufacturer Part Number 1: RC0603FR-135K1L; Mounting Type: SMD; Package: 0603; Supplier 1: Digi-Key; Supplier Part Number 1: 13-RC0603FR-135K1LCT-ND
TP6 TP7 TP33 = TESTPOINT_1MM_CIRCLE: TESTPOINT 1MM CIRCLE
TP8 = TESTPOINT_1MM_SQUARE: TESTPOINT 1MM SQUARE
U5 = BQ25756RRVR: as U5 on sheet HV Power Stage; Supplier 1: Digikey; Supplier Part Number 1: 296-BQ25756RRVRCT-ND; Manufacturer Part Number 1: BQ25756RRVR

## Sheet STM32 MCU.SchDoc
size A4; Engineer: Farris Matar; Organization: TESLA Motors, INC; Address1: 3500 Deer Creek Road; Address2: Palo Alto, CA; Address4: U.S.A.; SheetNumber: 9; SheetTotal: 13
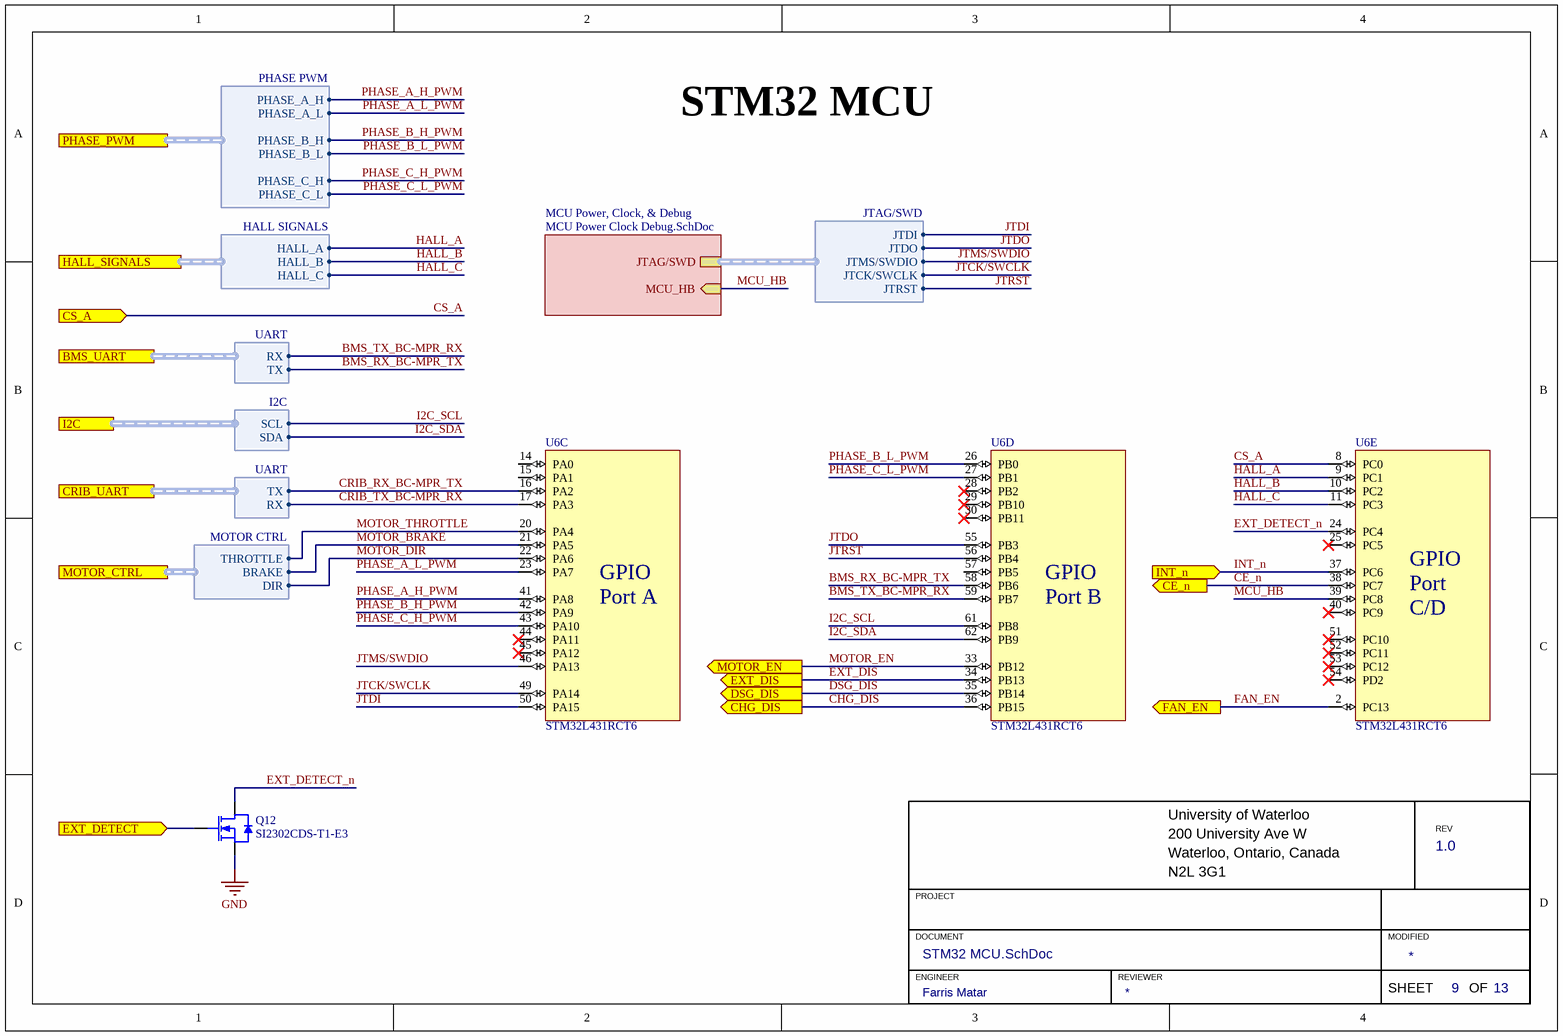
[diagram p7: STM32 MCU.SchDoc]

### Parts
Q12  Manufacturer Part Number 1: SI2302CDS-T1-E3  [SOT23-3]  (hidden comment: NMOS_20V_6A)
U6  STM32L431RCT6  [STM_LQFP64]  (parts C,D,E of 5)

### Sub-sheets
MCU Power, Clock, & Debug = MCU Power Clock Debug.SchDoc: JTAG/SWD (harness JTAG/SWD), MCU_HB (in)

### Ports
BMS_UART (harness UART), CE_n (out), CHG_DIS (out), CRIB_UART (harness UART), CS_A (in), DSG_DIS (out), EXT_DETECT (in), EXT_DIS (out), FAN_EN (out), HALL_SIGNALS (harness HALL SIGNALS), I2C (harness I2C), INT_n (in), MOTOR_CTRL (harness MOTOR CTRL), MOTOR_EN (out), PHASE_PWM (harness PHASE PWM)

### Harnesses
JTAG/SWD: JTRST, JTDI, JTMS/SWDIO, JTCK/SWCLK, JTDO
PHASE PWM: PHASE_A_H, PHASE_A_L, PHASE_B_H, PHASE_B_L, PHASE_C_H, PHASE_C_L
HALL SIGNALS: HALL_A, HALL_B, HALL_C
UART: TX, RX
I2C: SCL, SDA
MOTOR CTRL: THROTTLE, BRAKE, DIR

### Nets
GND: Q12.2(SOURCE)
BMS_RX_BC-MPR_TX: U6.58(PB6) ; port BMS_UART.TX
BMS_TX_BC-MPR_RX: U6.59(PB7) ; port BMS_UART.RX
CE_n: U6.38(PC7) ; port CE_n
CHG_DIS: U6.36(PB15) ; port CHG_DIS
CRIB_RX_BC-MPR_TX: U6.16(PA2) ; port CRIB_UART.TX
CRIB_TX_BC-MPR_RX: U6.17(PA3) ; port CRIB_UART.RX
CS_A: U6.8(PC0) ; port CS_A
DSG_DIS: U6.35(PB14) ; port DSG_DIS
EXT_DETECT: Q12.1(GATE) ; port EXT_DETECT
EXT_DETECT_n: Q12.3(DRAIN) U6.24(PC4)
EXT_DIS: U6.34(PB13) ; port EXT_DIS
FAN_EN: U6.2(PC13) ; port FAN_EN
HALL_A: U6.9(PC1) ; port HALL_SIGNALS.HALL_A
HALL_B: U6.10(PC2) ; port HALL_SIGNALS.HALL_B
HALL_C: U6.11(PC3) ; port HALL_SIGNALS.HALL_C
I2C_SCL: U6.61(PB8) ; port I2C.SCL  [project net I2C.SCL]
I2C_SDA: U6.62(PB9) ; port I2C.SDA  [project net I2C.SDA]
INT_n: U6.37(PC6) ; port INT_n
JTCK/SWCLK: U6.49(PA14) ; sheet MCU Power, Clock, & Debug/JTAG/SWD.JTCK/SWCLK
JTDI: U6.50(PA15) ; sheet MCU Power, Clock, & Debug/JTAG/SWD.JTDI
JTDO: U6.55(PB3) ; sheet MCU Power, Clock, & Debug/JTAG/SWD.JTDO
JTMS/SWDIO: U6.46(PA13) ; sheet MCU Power, Clock, & Debug/JTAG/SWD.JTMS/SWDIO
JTRST: U6.56(PB4) ; sheet MCU Power, Clock, & Debug/JTAG/SWD.JTRST
MCU_HB: U6.39(PC8) ; sheet MCU Power, Clock, & Debug/MCU_HB
MOTOR_BRAKE: U6.21(PA5) ; port MOTOR_CTRL.BRAKE
MOTOR_DIR: U6.22(PA6) ; port MOTOR_CTRL.DIR  [project net MOTOR_CTRL.DIR]
MOTOR_EN: U6.33(PB12) ; port MOTOR_EN
MOTOR_THROTTLE: U6.20(PA4) ; port MOTOR_CTRL.THROTTLE  [project net MOTOR_CTRL.THROTTLE]
PHASE_A_H_PWM: U6.41(PA8) ; port PHASE_PWM.PHASE_A_H
PHASE_A_L_PWM: U6.23(PA7) ; port PHASE_PWM.PHASE_A_L
PHASE_B_H_PWM: U6.42(PA9) ; port PHASE_PWM.PHASE_B_H
PHASE_B_L_PWM: U6.26(PB0) ; port PHASE_PWM.PHASE_B_L
PHASE_C_H_PWM: U6.43(PA10) ; port PHASE_PWM.PHASE_C_H
PHASE_C_L_PWM: U6.27(PB1) ; port PHASE_PWM.PHASE_C_L

Not connected (* = marked no-connect by the designer): U6 14(PA0) 15(PA1) 25(PC5)* 28(PB2)* 29(PB10)* 30(PB11)* 40(PC9)* 44(PA11)* 45(PA12)* 51(PC10)* 52(PC11)* 53(PC12)* 54(PD2)* 57(PB5)

### Notes on the sheet
- STM32 MCU
- University of Waterloo
- 200 University Ave W
- REV
- PROJECT
- Waterloo, Ontario, Canada
- N2L 3G1
- DOCUMENT
- ENGINEER
- REVIEWER
- MODIFIED
- SHEET
- OF
- (in symbol STM32L431RCT6, part C) GPIO / Port A
- (in symbol STM32L431RCT6, part D) GPIO / Port B
- (in symbol STM32L431RCT6, part E) GPIO / Port C/D

### Library data of the parts
Q12 = NMOS_20V_2.6A: as Q11 on sheet Motor Power Switch; Supplier 1: Digi-Key; Supplier Part Number 1: SI2302CDS-T1-E3CT-ND
U6 = STM32L431RCT6: IC MCU 32BIT 256KB FLASH 64LQFP; Manufacturer 1: STMicroelectronics; Package/Footprint: 64-LQFP; Manufacturer Part Number 1: STM32L431RCT6; Supplier 1: Digi-Key; Supplier Part Number 1: 497-17960-ND